# EAGLE design Cubesat_Potencia_Backup-rev2 (EAGLE 7.2.0)

## Sheet 1 of 4: Controle Painel Solar+ Mux AD
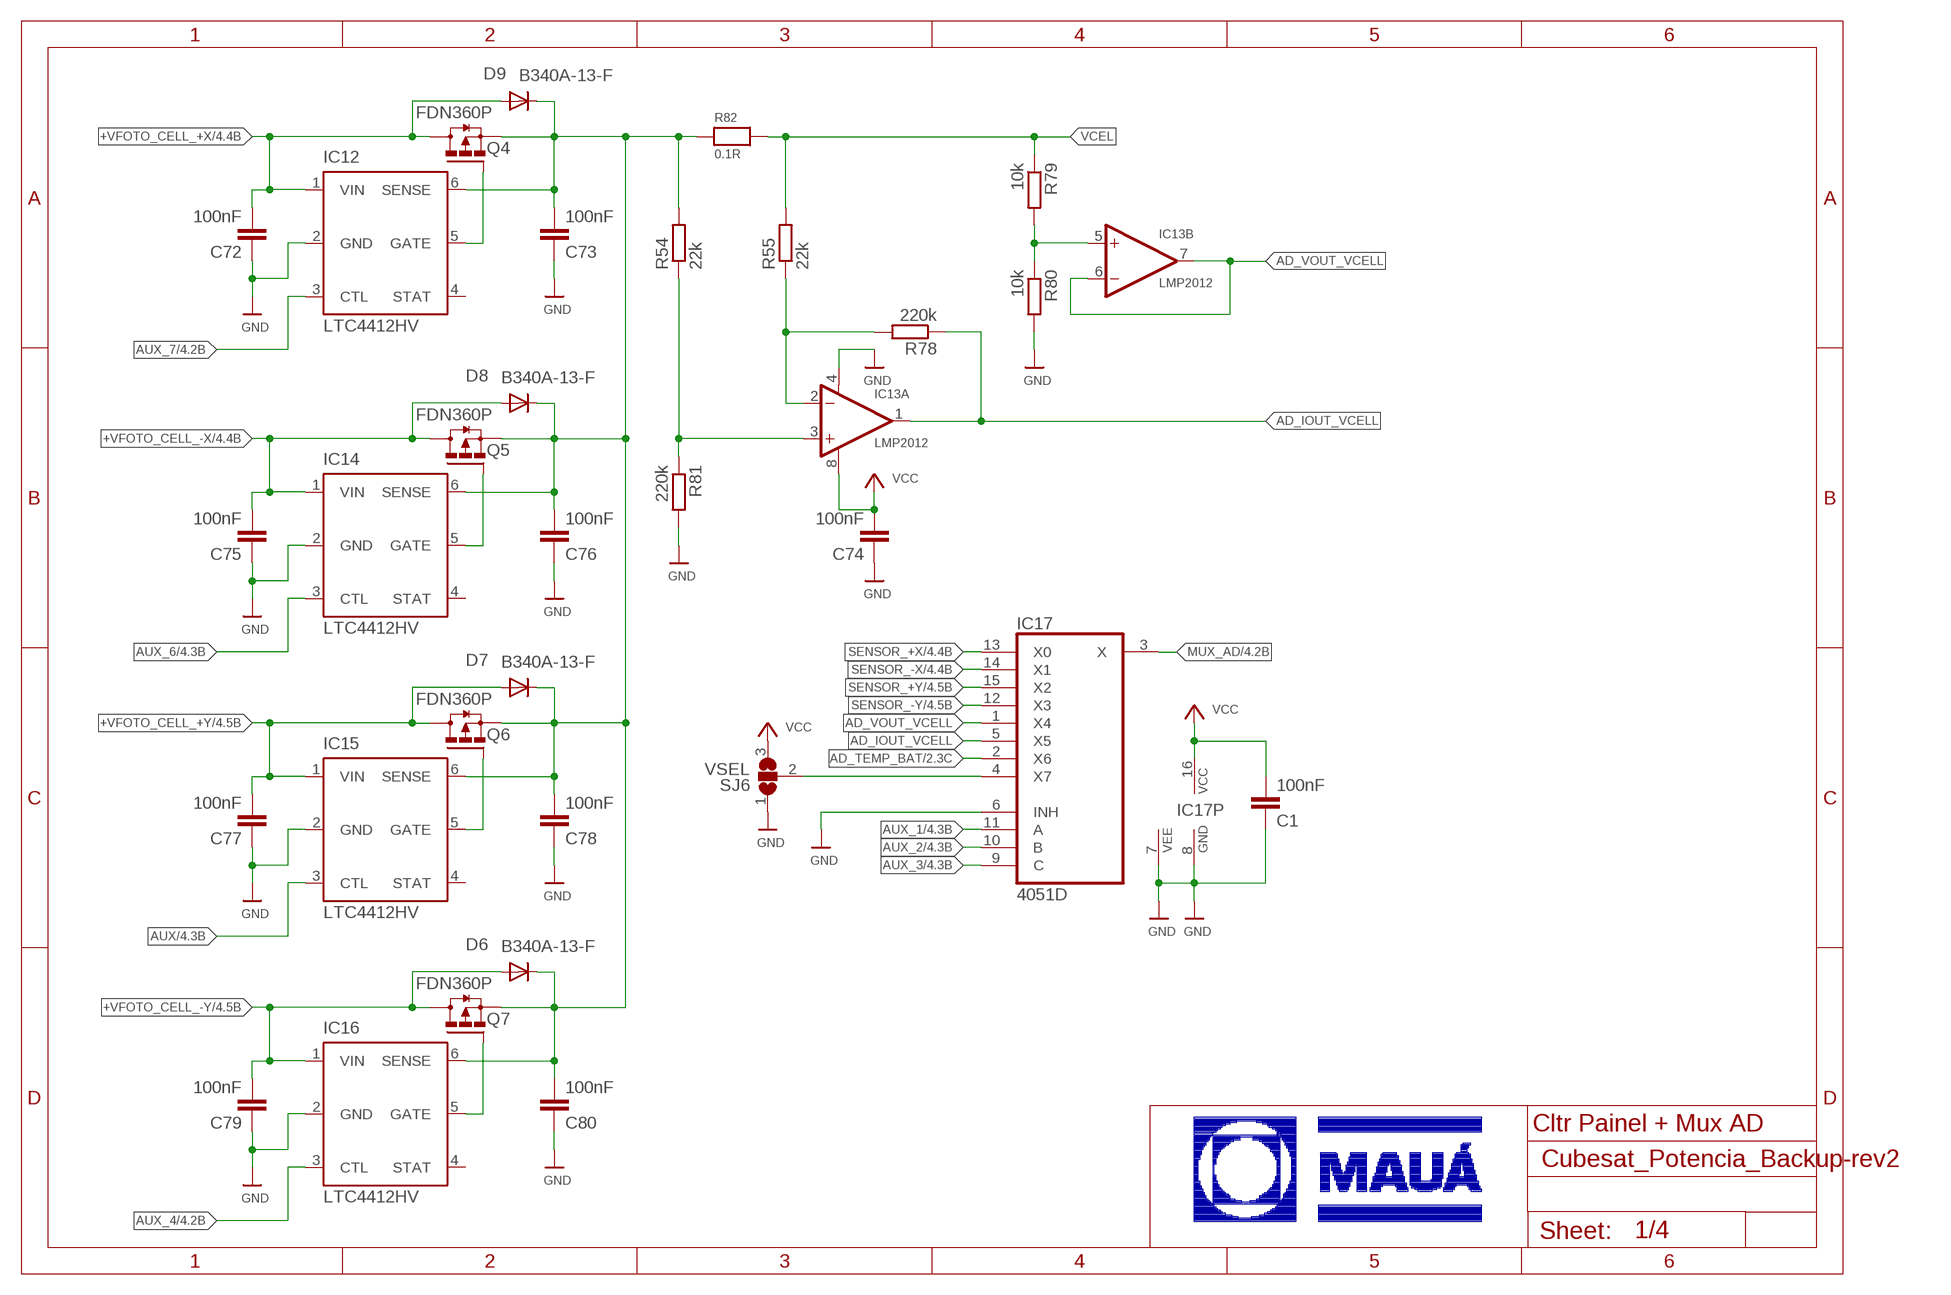
[diagram p0: schematic, sheet 1]

### Parts
C1  100nF  C-EUC0805  [C0805]
C72  100nF  C-EUC0805  [C0805]
C73  100nF  C-EUC0805  [C0805]
C74  100nF  C-EUC0805  [C0805]
C75  100nF  C-EUC0805  [C0805]
C76  100nF  C-EUC0805  [C0805]
C77  100nF  C-EUC0805  [C0805]
C78  100nF  C-EUC0805  [C0805]
C79  100nF  C-EUC0805  [C0805]
C80  100nF  C-EUC0805  [C0805]
D6  B340A-13-F  DIODE-DO214AC  [DO214AC]
D7  B340A-13-F  DIODE-DO214AC  [DO214AC]
D8  B340A-13-F  DIODE-DO214AC  [DO214AC]
D9  B340A-13-F  DIODE-DO214AC  [DO214AC]
IC12  LTC4412HV  [TSOT23-6]
IC13  LMP2012  OPA2237E  [MSOP08]
IC14  LTC4412HV  [TSOT23-6]
IC15  LTC4412HV  [TSOT23-6]
IC16  LTC4412HV  [TSOT23-6]
IC17  4051D  [SO16]
Q4  FDN360P  [SUPER-SOT3]
Q5  FDN360P  [SUPER-SOT3]
Q6  FDN360P  [SUPER-SOT3]
Q7  FDN360P  [SUPER-SOT3]
R54  22k  R-EU_M0805  [M0805]
R55  22k  R-EU_M0805  [M0805]
R78  220k  R-EU_M0805  [M0805]
R79  10k  R-EU_M0805  [M0805]
R80  10k  R-EU_M0805  [M0805]
R81  220k  R-EU_M0805  [M0805]
R82  0.1R  RESISTOR2818  [_2818]
SJ6  VSEL  SJ2W  [SJ_2]

### Nets
+VFOTO_CELL_+X: C72.2 D9.A IC12.1(VIN) Q4.3(D) ; also sheet 4
+VFOTO_CELL_+Y: C77.2 D7.A IC15.1(VIN) Q6.3(D) ; also sheet 4
+VFOTO_CELL_-X: C75.2 D8.A IC14.1(VIN) Q5.3(D) ; also sheet 4
+VFOTO_CELL_-Y: C79.2 D6.A IC16.1(VIN) Q7.3(D) ; also sheet 4
AD_IOUT_VCELL: IC13.1(A:OUT) IC17.5(X5) R78.1
AD_TEMP_BAT: IC17.2(X6) ; also sheet 2
AD_VOUT_VCELL: IC13.6(B:-IN) IC13.7(B:OUT) IC17.1(X4)
AUX: IC15.3(CTL) ; also sheet 4
AUX_1: IC17.11(A) ; also sheet 4
AUX_2: IC17.10(B) ; also sheet 4
AUX_3: IC17.9(C) ; also sheet 4
AUX_4: IC16.3(CTL) ; also sheet 4
AUX_6: IC14.3(CTL) ; also sheet 4
AUX_7: IC12.3(CTL) ; also sheet 4
GND: C1.1 C72.1 C73.1 C74.1 C75.1 C76.1 C77.1 C78.1 C79.1 C80.1 IC12.2(GND) IC13.4(A:V-) IC14.2(GND) IC15.2(GND) IC16.2(GND) IC17.6(INH) IC17.7(VEE) IC17.8(GND) R80.2 R81.2 SJ6.1 ; also sheet 2,3,4
MUX_AD: IC17.3(X) ; also sheet 4
N$74: IC12.5(GATE) Q4.1(G)
N$75: IC13.5(B:+IN) R79.2 R80.1
N$76: IC13.2(A:-IN) R55.1 R78.2
N$77: IC13.3(A:+IN) R54.1 R81.1
N$78: C73.2 C76.2 C78.2 C80.2 D6.C D7.C D8.C D9.C IC12.6(SENSE) IC14.6(SENSE) IC15.6(SENSE) IC16.6(SENSE) Q4.2(S) Q5.2(S) Q6.2(S) Q7.2(S) R54.2 R82.1
N$79: IC17.4(X7) SJ6.2
N$81: IC14.5(GATE) Q5.1(G)
N$82: IC15.5(GATE) Q6.1(G)
N$83: IC16.5(GATE) Q7.1(G)
SENSOR_+X: IC17.13(X0) ; also sheet 4
SENSOR_+Y: IC17.15(X2) ; also sheet 4
SENSOR_-X: IC17.14(X1) ; also sheet 4
SENSOR_-Y: IC17.12(X3) ; also sheet 4
VCC: C1.2 C74.2 IC13.8(A:V+) IC17.16(VCC) SJ6.3 ; also sheet 2,4
VCEL: R55.2 R79.1 R82.2 ; also sheet 2
Unconnected: IC12.4(STAT) IC14.4(STAT) IC15.4(STAT) IC16.4(STAT)

### Notes on the sheet
- Cltr Painel + Mux AD

## Sheet 2 of 4: Carregador de Bateria
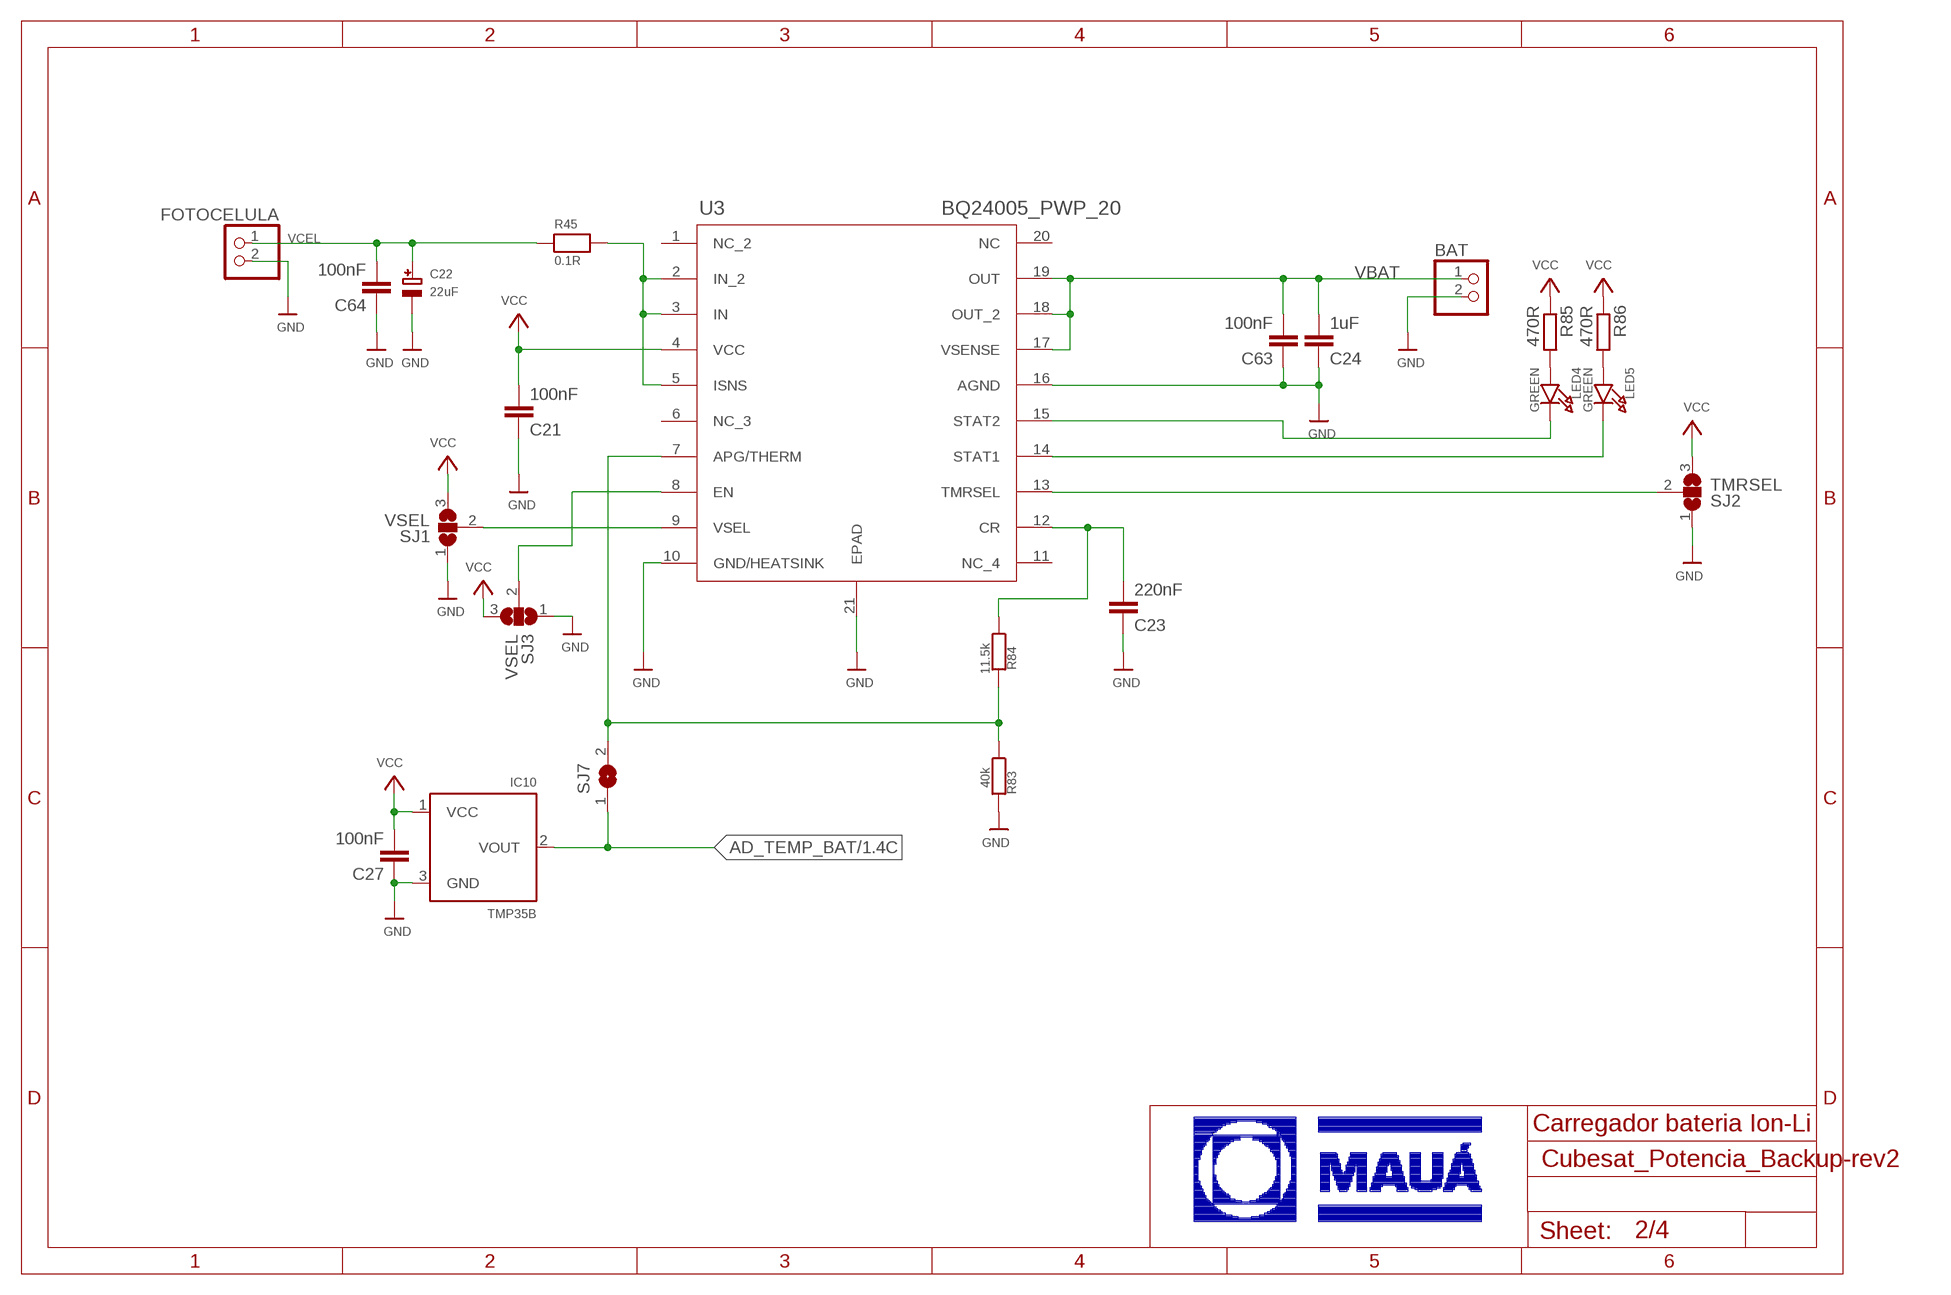
[diagram p1: schematic, sheet 2]

### Parts
BAT  HEADER-1X2  [1X02_OVAL]
C21  100nF  C-EUC0805  [C0805]
C22  22uF  CAP_TANTALUMC/6032_REFLOW  [EIA6032-28/C-R]
C23  220nF  C-EUC0805  [C0805]
C24  1uF  C-EUC0805  [C0805]
C27  100nF  C-EUC0805  [C0805]
C63  100nF  C-EUC0805  [C0805]
C64  100nF  C-EUC0805  [C0805]
FOTOCELULA  HEADER-1X2  [1X02_OVAL]
IC10  TMP35B  [TO92-LINE]
LED4  GREEN  LED0805  [CHIPLED_0805]
LED5  GREEN  LED0805  [CHIPLED_0805]
R45  0.1R  RESISTOR2818  [_2818]
R83  40k  R-EU_M0805  [M0805]
R84  11.5k  R-EU_M0805  [M0805]
R85  470R  R-EU_M0805  [M0805]
R86  470R  R-EU_M0805  [M0805]
SJ1  VSEL  SJ2W  [SJ_2]
SJ2  TMRSEL  SJ2W  [SJ_2]
SJ3  VSEL  SJ2W  [SJ_2]
SJ7  SOLDERJUMPER  [SOLDERJUMPER_ARROW_NOPASTE]
U3  BQ24005_PWP_20  [PWP20_2P4X3P4]

### Nets
AD_TEMP_BAT: IC10.2(VOUT) SJ7.1 ; also sheet 1
GND: BAT.2 C21.1 C22.- C23.1 C24.1 C27.1 C63.1 C64.1 FOTOCELULA.2 IC10.3(GND) R83.2 SJ1.1 SJ2.1 SJ3.1 U3.10(GND/HEATSINK) U3.16(AGND) U3.21(EPAD) ; also sheet 1,3,4
N$1: SJ3.2 U3.8(EN)
N$33: R45.2 U3.2(IN_2) U3.3(IN) U3.5(ISNS)
N$38: SJ2.2 U3.13(TMRSEL)
N$46: SJ1.2 U3.9(VSEL)
N$48: C23.2 R84.1 U3.12(CR)
N$80: LED4.A R85.2
N$84: R83.1 R84.2 SJ7.2 U3.7(APG/THERM)
N$86: LED5.A R86.2
N$87: LED5.C U3.14(STAT1)
N$88: LED4.C U3.15(STAT2)
VBAT: BAT.1 C24.2 C63.2 U3.17(VSENSE) U3.18(OUT_2) U3.19(OUT) ; also sheet 3,4
VCC: C21.2 C27.2 IC10.1(VCC) R85.1 R86.1 SJ1.3 SJ2.3 SJ3.3 U3.4(VCC) ; also sheet 1,4
VCEL: C22.+ C64.2 FOTOCELULA.1 R45.1 ; also sheet 1
Unconnected: U3.1(NC_2) U3.6(NC_3) U3.11(NC_4) U3.20(NC)

### Notes on the sheet
- Carregador bateria Ion-Li

## Sheet 3 of 4: Conversor BACKUP
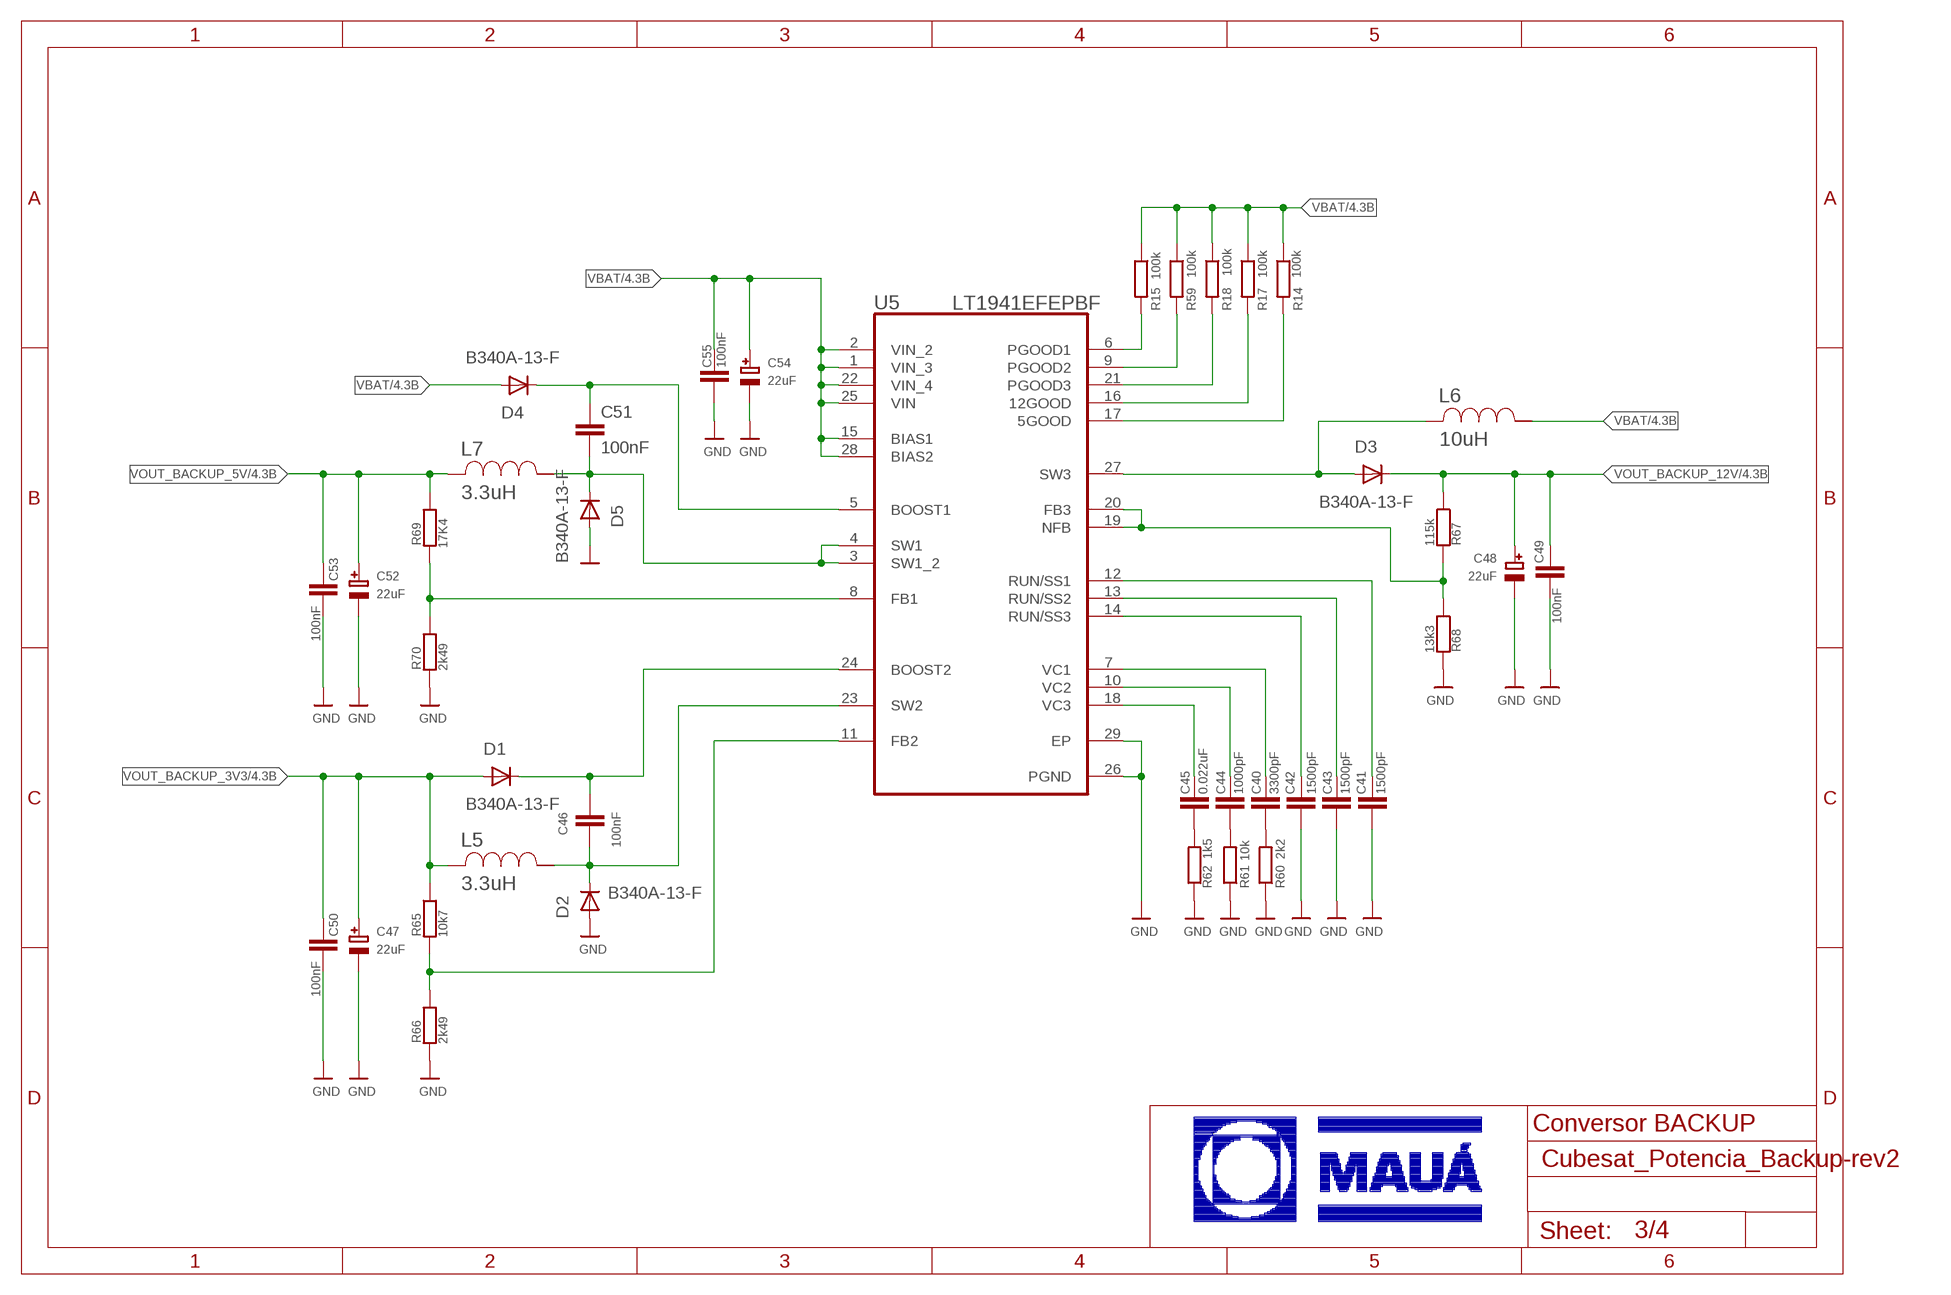
[diagram p2: schematic, sheet 3]

### Parts
C40  3300pF  C-EUC0805  [C0805]
C41  1500pF  C-EUC0805  [C0805]
C42  1500pF  C-EUC0805  [C0805]
C43  1500pF  C-EUC0805  [C0805]
C44  1000pF  C-EUC0805  [C0805]
C45  0.022uF  C-EUC0805  [C0805]
C46  100nF  C-EUC0805  [C0805]
C47  22uF  CAP_TANTALUMC/6032_REFLOW  [EIA6032-28/C-R]
C48  22uF  CAP_TANTALUMC/6032_REFLOW  [EIA6032-28/C-R]
C49  100nF  C-EUC0805  [C0805]
C50  100nF  C-EUC0805  [C0805]
C51  100nF  C-EUC1210  [C1210]
C52  22uF  CAP_TANTALUMC/6032_REFLOW  [EIA6032-28/C-R]
C53  100nF  C-EUC0805  [C0805]
C54  22uF  CAP_TANTALUMC/6032_REFLOW  [EIA6032-28/C-R]
C55  100nF  C-EUC0805  [C0805]
D1  B340A-13-F  DIODE-DO214AC  [DO214AC]
D2  B340A-13-F  DIODE-DO214AC  [DO214AC]
D3  B340A-13-F  DIODE-DO214AC  [DO214AC]
D4  B340A-13-F  DIODE-DO214AC  [DO214AC]
D5  B340A-13-F  DIODE-DO214AC  [DO214AC]
L5  3.3uH  SRR6038-3R3Y  [SRR6038]
L6  10uH  SRR6038-3R3Y  [SRR6038]
L7  3.3uH  SRR6038-3R3Y  [SRR6038]
R14  100k  R-EU_M0805  [M0805]
R15  100k  R-EU_M0805  [M0805]
R17  100k  R-EU_M0805  [M0805]
R18  100k  R-EU_M0805  [M0805]
R59  100k  R-EU_M0805  [M0805]
R60  2k2  R-EU_M0805  [M0805]
R61  10k  R-EU_M0805  [M0805]
R62  1k5  R-EU_M0805  [M0805]
R65  10k7  R-EU_M0805  [M0805]
R66  2k49  R-EU_M0805  [M0805]
R67  115k  R-EU_M0805  [M0805]
R68  13k3  R-EU_M0805  [M0805]
R69  17K4  R-EU_M0805  [M0805]
R70  2k49  R-EU_M0805  [M0805]
U5  LT1941EFEPBF  [SOP65P640X120-29N]

### Nets
BOOST1: C51.1 D4.C U5.5(BOOST1)
FB1: R69.2 R70.1 U5.8(FB1)
FB2: R65.2 R66.1 U5.11(FB2)
FB3: R67.2 R68.1 U5.19(NFB) U5.20(FB3)
GND: C41.2 C42.2 C43.2 C47.- C48.- C49.2 C50.2 C52.- C53.2 C54.- C55.2 D2.A D5.A R60.1 R61.1 R62.1 R66.2 R68.2 R70.2 U5.26(PGND) U5.29(EP) ; also sheet 1,2,4
N$19: R14.2 U5.17(5GOOD)
N$21: R17.2 U5.16(12GOOD)
N$27: R18.2 U5.21(PGOOD3)
N$29: R59.2 U5.9(PGOOD2)
N$54: R15.2 U5.6(PGOOD1)
N$55: C41.1 U5.12(RUN/SS1)
N$56: C43.1 U5.13(RUN/SS2)
N$57: C42.1 U5.14(RUN/SS3)
N$59: C40.1 R60.2
N$62: C44.2 U5.10(VC2)
N$63: C45.2 U5.18(VC3)
N$67: C44.1 R61.2
N$68: C45.1 R62.2
N$69: C40.2 U5.7(VC1)
N$70: C46.1 D1.C U5.24(BOOST2)
SW1: C51.2 D5.C L7.2 U5.3(SW1_2) U5.4(SW1)
SW2: C46.2 D2.C L5.2 U5.23(SW2)
SW3: D3.A L6.1 U5.27(SW3)
VBAT: C54.+ C55.1 D4.A L6.2 R14.1 R15.1 R17.1 R18.1 R59.1 U5.1(VIN_3) U5.2(VIN_2) U5.15(BIAS1) U5.22(VIN_4) U5.25(VIN) U5.28(BIAS2) ; also sheet 2,4
VOUT_BACKUP_3V3: C47.+ C50.1 D1.A L5.1 R65.1 ; also sheet 4
VOUT_BACKUP_5V: C52.+ C53.1 L7.1 R69.1 ; also sheet 4
VOUT_BACKUP_12V: C48.+ C49.1 D3.C R67.1 ; also sheet 4

### Notes on the sheet
- Conversor BACKUP

## Sheet 4 of 4: Barramento
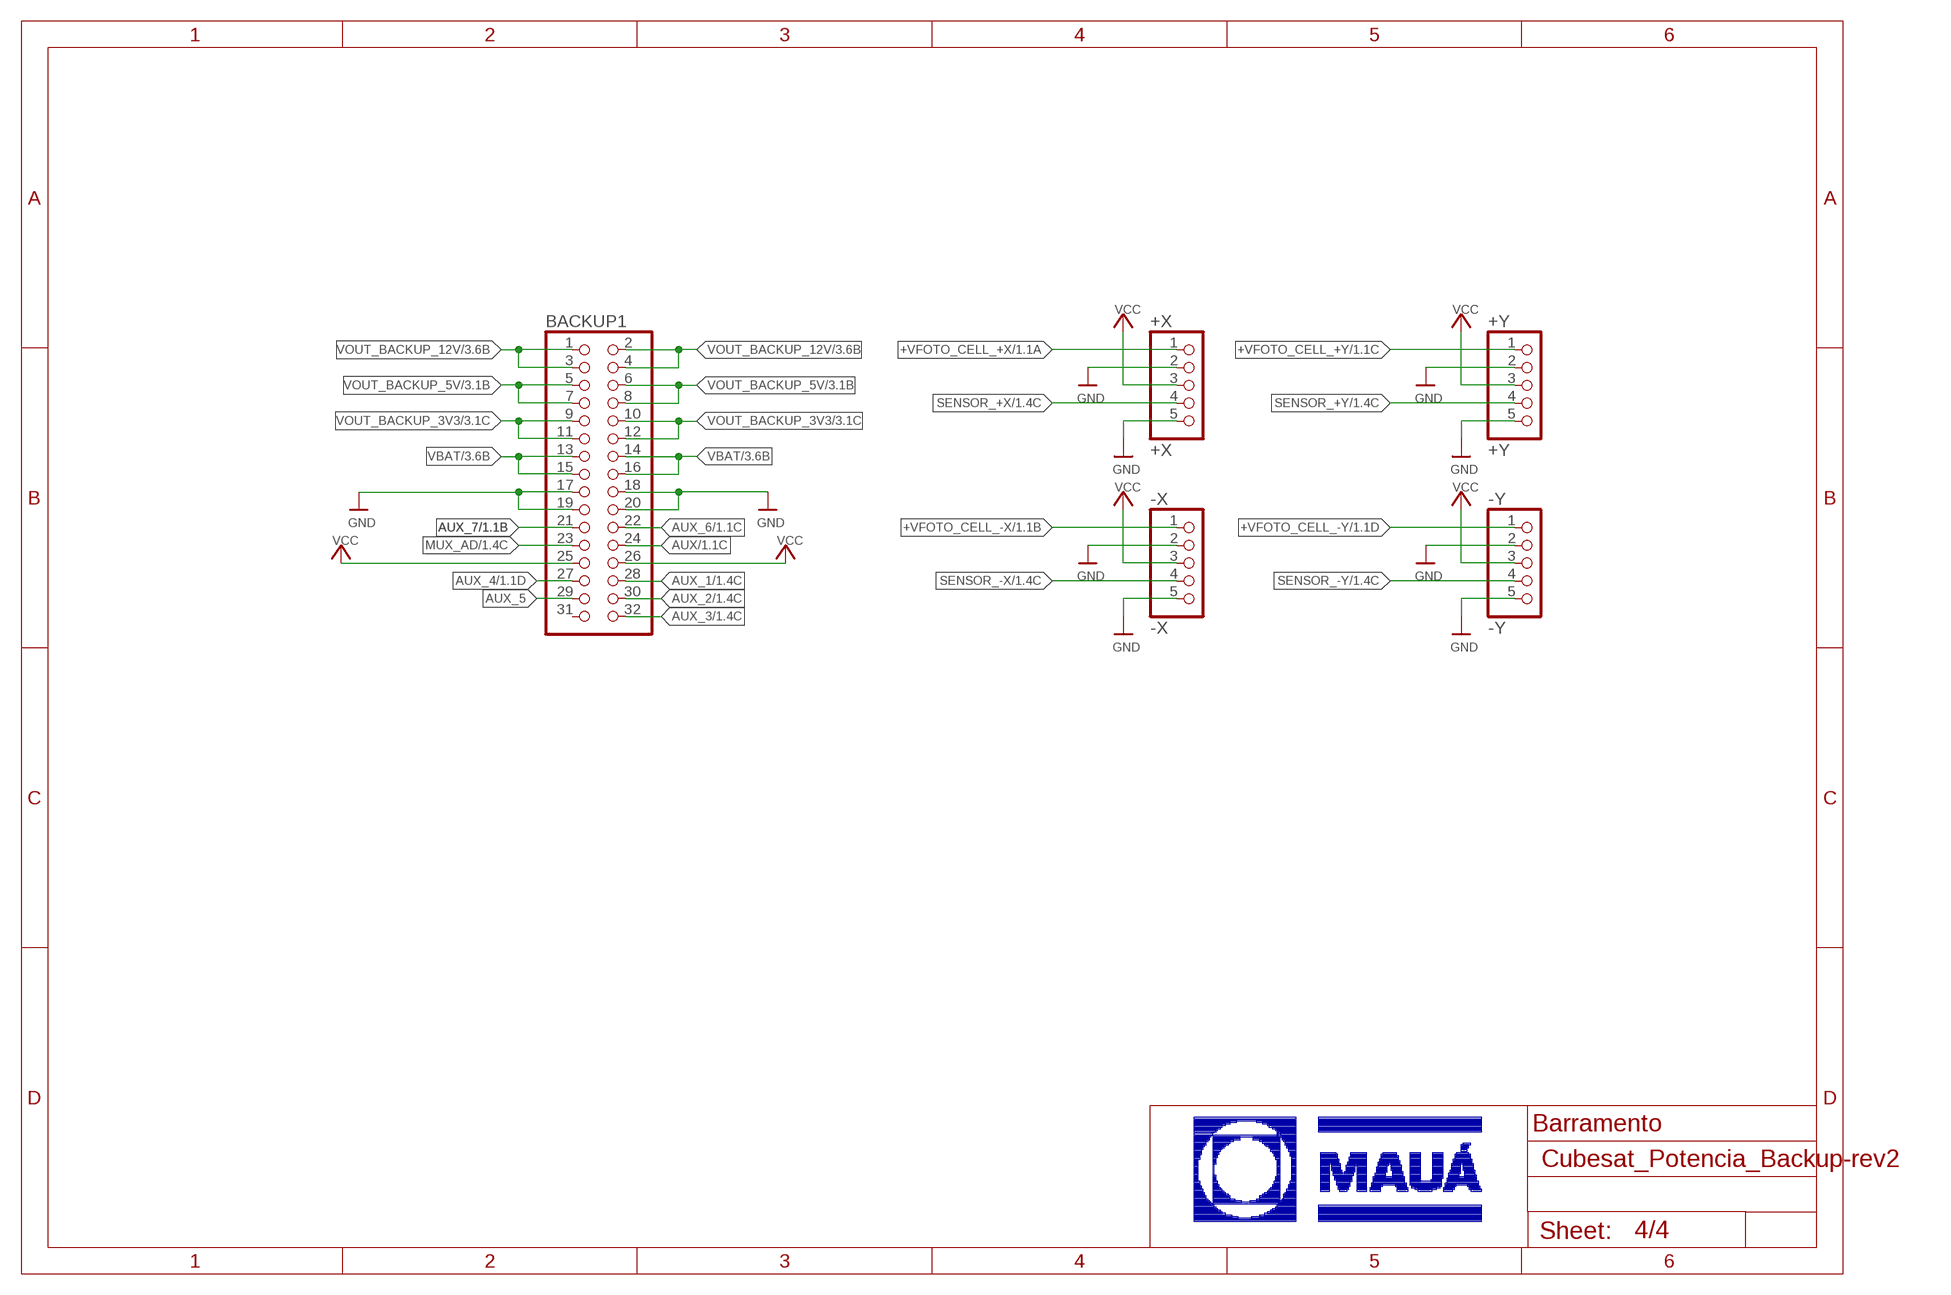
[diagram p3: schematic, sheet 4]

### Parts
+X  +X  PINHD-1X5  [1X05]
+Y  +Y  PINHD-1X5  [1X05]
-X  -X  PINHD-1X5  [1X05]
-Y  -Y  PINHD-1X5  [1X05]
BACKUP1  PINHD-2X16  [2X16]

### Nets
+VFOTO_CELL_+X: +X.1 ; also sheet 1
+VFOTO_CELL_+Y: +Y.1 ; also sheet 1
+VFOTO_CELL_-X: -X.1 ; also sheet 1
+VFOTO_CELL_-Y: -Y.1 ; also sheet 1
AUX: BACKUP1.24 ; also sheet 1
AUX_1: BACKUP1.28 ; also sheet 1
AUX_2: BACKUP1.30 ; also sheet 1
AUX_3: BACKUP1.32 ; also sheet 1
AUX_4: BACKUP1.27 ; also sheet 1
AUX_5: BACKUP1.29
AUX_6: BACKUP1.22 ; also sheet 1
AUX_7: BACKUP1.21 ; also sheet 1
GND: +X.2 +X.5 +Y.2 +Y.5 -X.2 -X.5 -Y.2 -Y.5 BACKUP1.17 BACKUP1.18 BACKUP1.19 BACKUP1.20 ; also sheet 1,2,3
MUX_AD: BACKUP1.23 ; also sheet 1
SENSOR_+X: +X.4 ; also sheet 1
SENSOR_+Y: +Y.4 ; also sheet 1
SENSOR_-X: -X.4 ; also sheet 1
SENSOR_-Y: -Y.4 ; also sheet 1
VBAT: BACKUP1.13 BACKUP1.14 BACKUP1.15 BACKUP1.16 ; also sheet 2,3
VCC: +X.3 +Y.3 -X.3 -Y.3 BACKUP1.25 BACKUP1.26 ; also sheet 1,2
VOUT_BACKUP_3V3: BACKUP1.9 BACKUP1.10 BACKUP1.11 BACKUP1.12 ; also sheet 3
VOUT_BACKUP_5V: BACKUP1.5 BACKUP1.6 BACKUP1.7 BACKUP1.8 ; also sheet 3
VOUT_BACKUP_12V: BACKUP1.1 BACKUP1.2 BACKUP1.3 BACKUP1.4 ; also sheet 3
Unconnected: BACKUP1.31

### Notes on the sheet
- Barramento

## Library data of the parts
+X +Y -X -Y = pinhead:PINHD-1X5: PIN HEADER
BACKUP1 = pinhead:PINHD-2X16: PIN HEADER
BAT FOTOCELULA = junior:HEADER-1X2: PIN HEADER
C1 C21 C23 C24 C27 C40-C46 C49-C51 C53 C55 C63 C64 C72-C80 = rcl:C-EU: CAPACITOR, European symbol
C22 C47 C48 C52 C54 = junior:CAP_TANTALUM: Tantalum Capacitors Wave footprints have larger pads and are meant to be used for hand soldering. Reflow footprints are optimised for solder paste and a reflow oven. EIA3216-18/A-[R/W] - Size A / 3216-18 / 1206 footprint 4.7µF 25V 10% Tantalum Capacitor 10µF 16V 10% Tantalum Capacitor [Digikey: 495-2236-2-ND] EIA3528-21/B-[R/W] - Size B / 3528-21 47µF 10V 10% Tantalum Capactior [Digikey: 495-2216-1-ND] EIA6032-28/C-[R/W] - Size C / 6032-28 10µF 35V 20% Tantalum Capacitor [Digikey: 495-2285-1-ND] 100µF 16V 10% Tantalum Capactior [Digikey: 399-5214-1-ND]
D1-D9 = diode:DIODE-: DIODE
IC10 = junior:TMP35
IC12 IC14-IC16 = linear-technology:LTC4412HV
IC13 = burr-brown:OPA2237: Single-Supply Operational Amplifiers MicroAmplifier(TM) Series; Product Folder:OPA2237; MF: TEXAS INSTRUMENTS; MPN: OPA2237EA/250; OC_FARNELL: 1470365; OC_NEWARK: 35C1853
IC17 = 40xx:4051: 8-channel ANALOG MULTIPLEXER
L5-L7 = lbr_tcc:SRR6038-3R3Y; DCR: 0.02; IDC: 3.5; L: 3.3E-6; MANUFACTURER_NAME: Bourns; MANUFACTURER_PART_NUMBER: SRR6038-3R3Y; VENDOR: Bourns
LED4 LED5 = junior:LED: LED 0603 - 0603 Surface Mount Package 2mA: Green LED - Low Power (3.9mcd, 2ma, 1.7Vf) - Digikey: 475-2709-2-ND Orange LED - Low Power (9.8mcd, 2ma, 1.8Vf) - Digikey: 475-1194-2-ND Red LED - Low Power (5mcd, 2ma, 1.8Vf) - Digikey: 475-1195-2-ND Yellow LED - Low Power (7mcd, 2ma, 1.8Vf) - Digikey: 475-1196-2-ND 5mA: Blue LED - Low Power (17mcd, 5ma, 2.9Vf) - Digikey: LNJ937W8CRACT-ND 0805 - 0805 Surface Mount Package 2mA: Red LED (8.8mcd, 2mA, 1.8Vf, Clear) - Low Power [Digikey: 475-2510-1-ND] Green LED (5mcd, 2mA, 1.8Vf, Clear) - Low Power [Digikey: 475-2730-1-ND] Yellow LED (11.3mcd, 2mA, 1.8Vf, Clear) - Low Power [Digikey: 475-2555-1-ND] 20mA: Red LED (104mcd, 20mA, Diffused) - LS R976 [Digikey: 475-1278-6-ND] Red LED (12mcd, 20mA, 2.0Vf, Clear) - APT2012EC [Digikey: 754-1128-1-ND] Green LED (15mcd, 20mA, 2.2Vf, Clear) - APT2012GC [Digikey: 754-1131-1-ND] Orange LED (160mcd, 20mA, 2.1Vf, Clear) - APT2012SECK [Digikey: 754-1130-1-ND] 1206 - 1206 Surface Mount Package Green LED (26mcd, 20mA, Diffused) - LG N971 [Digikey: 475-1407-6-ND] Red LED (15mcd, 20mA, Diffused) - LH N974 [Digikey: 475-1416-6-ND]
Q4-Q7 = transistor-power:FDN360P: Single P-Channel, PowerTrench (R) MOSFET Source: http://www.fairchildsemi.com/ds/FD/FDN360P.pdf
R14 R15 R17 R18 R54 R55 R59-R62 R65-R70 R78-R81 R83-R86 = rcl:R-EU_: RESISTOR, European symbol
R45 R82 = junior:RESISTOR: Resistors 0402 - 0402 Surface Mount Package 22 Ohm 1% 1/16W [Digikey: 311-22.0LRTR-ND] 33 Ohm 5% 1/16W 1.0K 5% 1/16W 1.5K 5% 1/16W 2.0K 1% 1/16W 10.0K 1% 1/16W [Digikey: 311-10.0KLRTR-ND] 10.0K 5% 1/16W [Digikey: RMCF0402JT10K0TR-ND] 12.1K 1% 1/16W [Digikey: 311-22.0LRTR-ND] 100.0K 5% 1/16W 0603 - 0603 Surface Mount Package 0 Ohm 1/10 Watt 1% Resistor 15 Ohm 1/10 Watt 1% Resistor 33 Ohm 1/10 Watt 1% Resistor 49.9 Ohm 1/10 Watt 1% Resistor 100 Ohm 1/10 Watt 1% Resistor 150 Ohm 1/10 Watt 1% Resistor 240 Ohm 1/10 Watt 1% Resistor 390 Ohm 1/10 Watt 1% Resistor 560 Ohm 1/10 Watt 1% Resistor 680 Ohm 1/10 Watt 1% Resistor 750 Ohm 1/10 Watt 1% Resistor 1.0K Ohm 1/10 Watt 1% Resistor 1.5K Ohm 1/10 Watt 1% Resistor 2.0K Ohm 1/10 Watt 1% Resistor 2.2K Ohm 1/10 Watt 1% Resistor 3.3K Ohm 1/10 Watt 1% Resistor 4.7K Ohm 1/10 Watt 1% Resistor 10.0K Ohm 1/10 Watt 1% Resistor 12.0K Ohm 1/10 Watt 1% Resistor 12.1K Ohm 1/10 Watt 1% Resistor 20.0K Ohm 1/10 Watt 1% Resistor 33.0K Ohm 1/10 Watt 1% Resistor 100.0K Ohm 1/10 Watt 1% Resistor 0805 - 0805 Surface Mount Package 0 Ohm 1/8 Watt 1% Resistor 33 Ohm 1/8 Watt 1% Resistor 100 Ohm 1/8 Watt 1% Resistor 150 Ohm 1/8 Watt 1% Resistor 200 Ohm 1/8 Watt 1% Resistor 240 Ohm 1/8 Watt 1% Resistor 330 Ohm 1/8 Watt 1% Resistor 390 Ohm 1/8 Watt 1% Resistor 470 Ohm 1/8 Watt 1% Resistor 1.0K Ohm 1/8 Watt 1% Resistor 1.5K Ohm 1/8 Watt 1% Resistor 2.0K Ohm 1/8 Watt 1% Resistor 4.7K Ohm 1/8 Watt 1% Resistor 5.1K Ohm 1/8 Watt 1% Resistor 5.6K Ohm 1/8 Watt 1% Resistor 10.0K Ohm 1/8 Watt 1% Resistor 22.0K Ohm 1/8 Watt 1% Resistor 33.0K Ohm 1/8 Watt 1% Resistor 100K Ohm 1/8 Watt 1% Resistor 1206 - 1206 Surface Mount Package 2012 - 2010 Surface Mount Package 0.11 Ohm 1/2 Watt 1% Resistor - Digikey: RHM.11UCT-ND
SJ1-SJ3 SJ6 = jumper:SJ2W: SMD solder JUMPER
SJ7 = junior:SOLDERJUMPER: SMD Solder JUMPER Solder the two pads together to create a connection, or remove the solder to break it. REFLOW - Use this footprint for solder paste and reflow ovens. WAVE - Use this footprint for hand-soldering (larger pads). CLOSED - Has a trace between the two pads to ensure it is closed by default. The trace needs to be cut to disable the jumper, and can be closed again by creating a solder bridge between the two pads.; BOM: EXCLUDE
U3 = BQ24005:BQ24005_PWP_20; DATASHEETURL: http://www.ti.com/lit/gpn/BQ24005; DESCRIPTION: Linear 2-cell Li-Ion Battery Charger w/Integrated FET, Two LED; FAMILY_NAME: BATTERY CHARGE MANAGEMENT; GENERIC_PART_NUMBER: BQ24005; INDUSTRY_STD_PKG_TYPE: HTSSOP; MANUFACTURER: Texas Instruments; PACKAGE_DESIGNATOR: PWP; PIN_COUNT: 20
U5 = LTC_By_element14_Batch_1:LT1941EFEPBF: Switching Regulator; MPN: LT1941EFE#PBF; OC_FARNELL: 1273793; OC_NEWARK: 58M1020; PACKAGE: TSSOP-28; SUPPLIER: Linear Technology

## Board
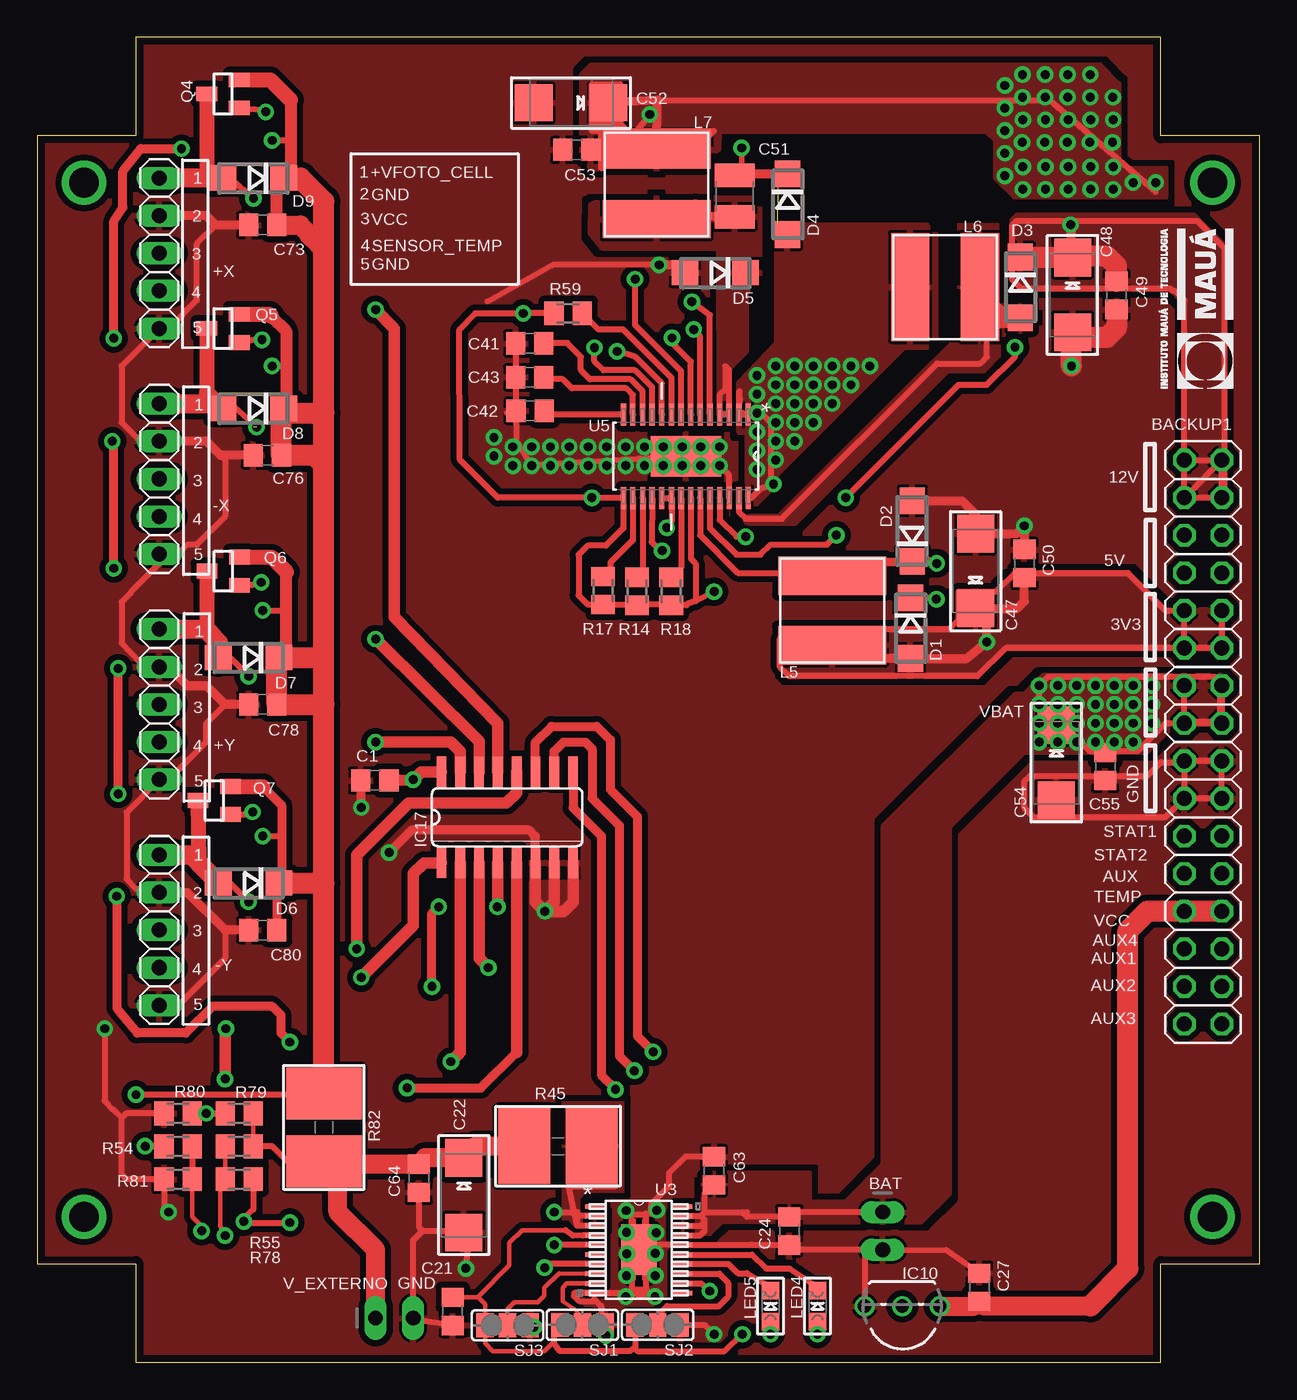
[diagram p4: board, top side]
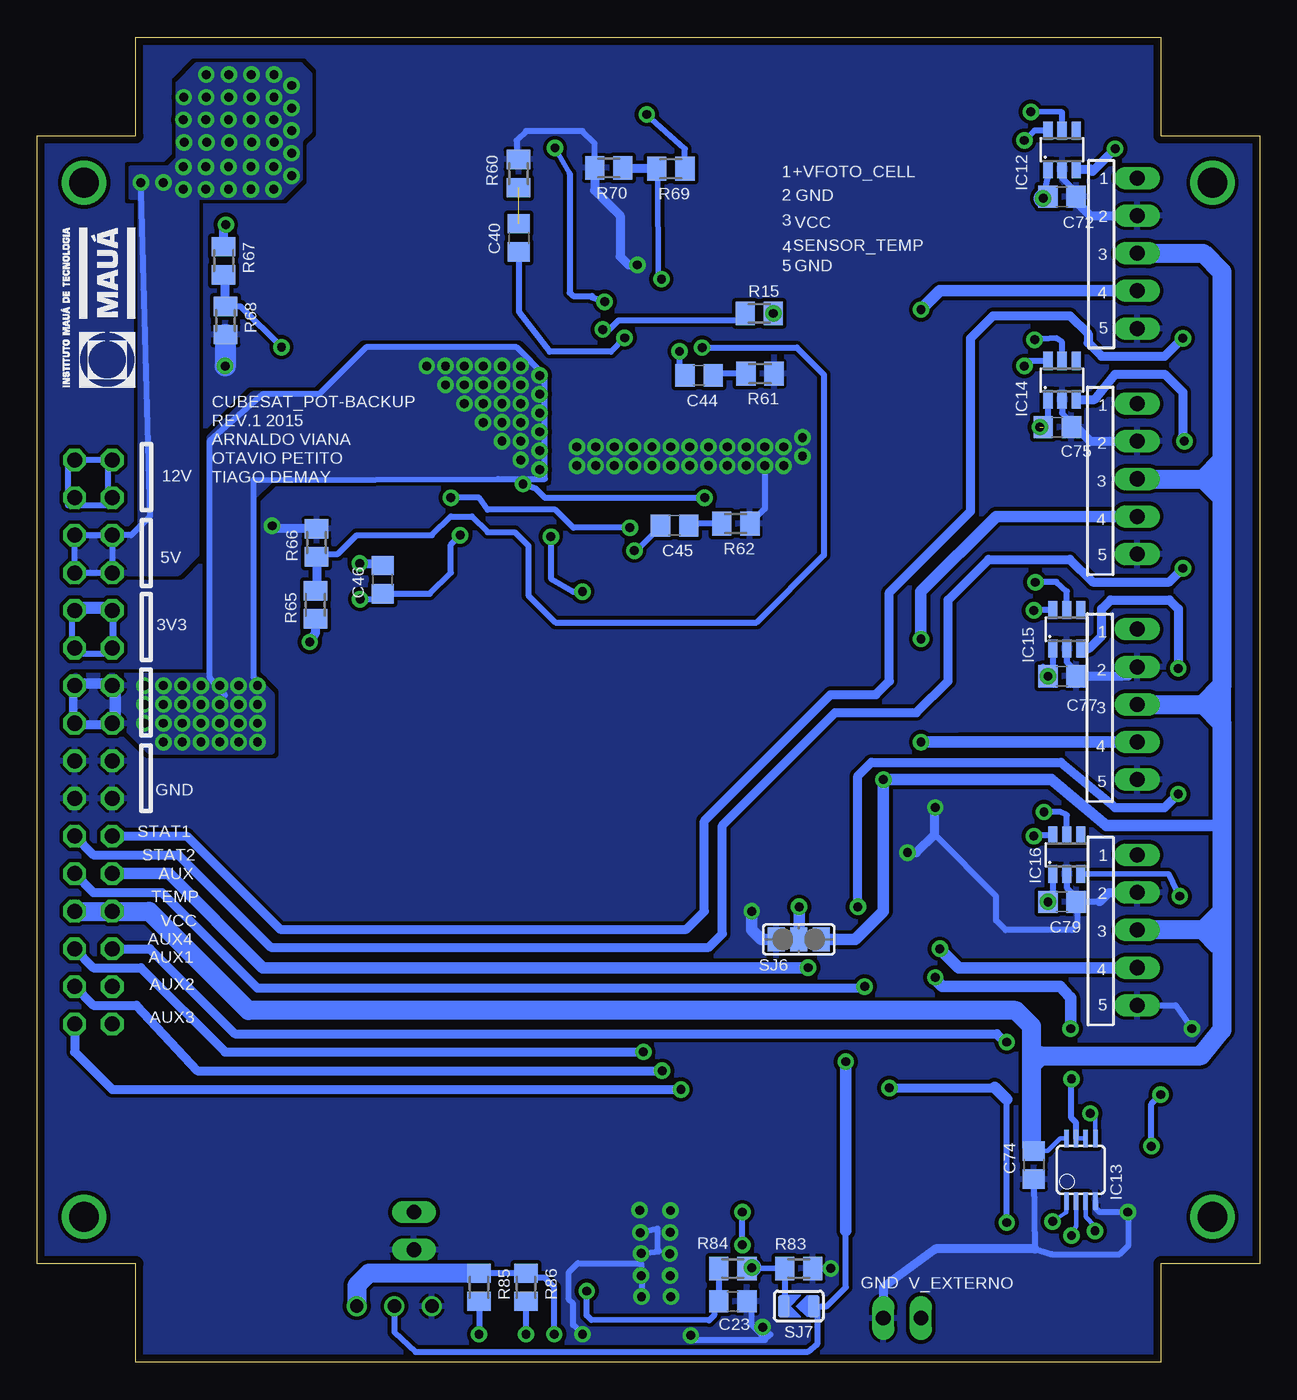
[diagram p5: board, bottom side, seen from below]

Size 82.55 x 89.53 mm. Coordinates in mm from the lower left corner, seen from the top.
Outline: 0,82.87 0,6.67 6.67,6.67 6.67,0 75.88,0 75.88,6.67 82.55,6.67 82.55,82.87 75.88,82.87 75.88,89.53 6.67,89.53 6.67,82.87 0,82.87
Copper layers (1*16): Top 0.035mm / dielectric 1.5mm / Bottom 0.035mm
Design rules "default": minimum track width 8mil, minimum drill 0.4mm, track to track 8mil, track to pad 8mil, pad to pad 8mil, via to via 8mil, smd to smd 8mil, copper to edge 20mil, drill to drill 8mil, minimum pad ring 8mil, minimum via ring 10mil, stop-mask expansion 3mil, vias tented up to drill 0mil, thermal gap 8mil

### Footprints (pad centres in the part's own frame; a part is rotated, then mirrored left to right if it is on the bottom)
1X05 = drill 1.016 long: 1 -5.08,0; 2 -2.54,0; 3 0,0; 4 2.54,0; 5 5.08,0
2X16 = drill 1.016 octagon: 1 -19.05,-1.27; 2 -19.05,1.27; 3 -16.51,-1.27; 4 -16.51,1.27; 5 -13.97,-1.27; 6 -13.97,1.27; 7 -11.43,-1.27; 8 -11.43,1.27; 9 -8.89,-1.27; 10 -8.89,1.27; 11 -6.35,-1.27; 12 -6.35,1.27; 13 -3.81,-1.27; 14 -3.81,1.27; 15 -1.27,-1.27; 16 -1.27,1.27; 17 1.27,-1.27; 18 1.27,1.27; 19 3.81,-1.27; 20 3.81,1.27; 21 6.35,-1.27; 22 6.35,1.27; 23 8.89,-1.27; 24 8.89,1.27; 25 11.43,-1.27; 26 11.43,1.27; 27 13.97,-1.27; 28 13.97,1.27; 29 16.51,-1.27; 30 16.51,1.27; 31 19.05,-1.27; 32 19.05,1.27
1X02_OVAL = drill 1 long: 1 -1.27,0; 2 1.27,0
C0805 = smd 1.3 x 1.5: 1 -0.95,0; 2 0.95,0
EIA6032-28/C-R = smd 2.55 x 2.5: + 2.525,0; - -2.525,0
C1210 = smd 1.6 x 2.7: 1 -1.4,0; 2 1.4,0
DO214AC = smd 1.8 x 1.7: A 2.05,0; C -2.05,0
TO92-LINE = drill 0.9: 1 -2.54,0; 2 0,0; 3 2.54,0
TSOT23-6 = smd 0.62 x 1.22: 1 -0.95,-1.3; 2 0,-1.3; 3 0.95,-1.3; 4 0.95,1.3; 5 0,1.3; 6 -0.95,1.3
MSOP08 = smd 0.3 x 1.2: 1 -0.976,-2.113; 2 -0.326,-2.113; 3 0.324,-2.113; 4 0.974,-2.113; 5 0.974,2.112; 6 0.324,2.112; 7 -0.326,2.112; 8 -0.976,2.112
SO16 = smd 0.66 x 2.032: 1 -4.445,-3.073; 2 -3.175,-3.073; 3 -1.905,-3.073; 4 -0.635,-3.073; 5 0.635,-3.073; 6 1.905,-3.073; 7 3.175,-3.073; 8 4.445,-3.073; 9 4.445,3.073; 10 3.175,3.073; 11 1.905,3.073; 12 0.635,3.073; 13 -0.635,3.073; 14 -1.905,3.073; 15 -3.175,3.073; 16 -4.445,3.073
SRR6038 = smd 2.591 x 7.29: 1 -2.349,0; 2 2.349,0
CHIPLED_0805 = smd 1.2 x 1.2: A 0,-1.05; C 0,1.05
SUPER-SOT3 = smd 1 x 1.4: 1 -0.95,-1.1; 2 0.95,-1.1; 3 0,1.1
M0805 = smd 1.3 x 1.6: 1 -0.95,0; 2 0.95,0
_2818 = smd 3.5 x 5.1: 1 -2.286,0; 2 2.286,0
SJ_2 = smd 1.168 x 1.6: 1 -1.524,0; 2 0,0; 3 1.524,0
SOLDERJUMPER_ARROW_NOPASTE = smd 0.762 x 1.524: 1 -1.016,0; 2 1.016,0
PWP20_2P4X3P4 = smd 1.27 x 0.305: 1 -2.972,2.921; 2 -2.972,2.286; 3 -2.972,1.626; 4 -2.972,0.965; 5 -2.972,0.33; 6 -2.972,-0.33; 7 -2.972,-0.965; 8 -2.972,-1.626; 9 -2.972,-2.286; 10 -2.972,-2.921; 11 2.972,-2.921; 12 2.972,-2.286; 13 2.972,-1.626; 14 2.972,-0.965; 15 2.972,-0.33; 16 2.972,0.33; 17 2.972,0.965; 18 2.972,1.626; 19 2.972,2.286; 20 2.972,2.921 | smd 2.388 x 3.404: 21 0,0
SOP65P640X120-29N = smd 1.473 x 0.356: 1 -2.819,4.216; 2 -2.819,3.581; 3 -2.819,2.921; 4 -2.819,2.286; 5 -2.819,1.626; 6 -2.819,0.965; 7 -2.819,0.33; 8 -2.819,-0.33; 9 -2.819,-0.965; 10 -2.819,-1.626; 11 -2.819,-2.286; 12 -2.819,-2.921; 13 -2.819,-3.581; 14 -2.819,-4.216; 15 2.819,-4.216; 16 2.819,-3.581; 17 2.819,-2.921; 18 2.819,-2.286; 19 2.819,-1.626; 20 2.819,-0.965; 21 2.819,-0.33; 22 2.819,0.33; 23 2.819,0.965; 24 2.819,1.626; 25 2.819,2.286; 26 2.819,2.921; 27 2.819,3.581; 28 2.819,4.216 | smd 2.743 x 4.75: 29 0,0

### Placement (x,y rotation side)
+X  8.26,74.93 270 top
+Y  8.26,44.45 270 top
-X  8.26,59.69 270 top
-Y  8.26,29.21 270 top
BACKUP1  78.74,41.91 270 top
BAT  57.1,8.89 270 top
C1  22.81,39.32 0 top
C21  28.07,3.45 90 top
C22  28.83,11.3 90 top
C23  35.56,4.13 180 bottom
C24  50.8,8.89 90 top
C27  63.63,5.08 270 top
C40  50.01,75.97 270 bottom
C41  33.27,68.83 180 top
C42  33.3,64.29 180 top
C43  33.27,66.55 180 top
C44  37.85,66.67 180 bottom
C45  39.5,56.54 180 bottom
C46  59.21,52.88 90 bottom
C47  63.37,53.47 270 top
C48  69.93,72.11 90 top
C49  72.9,72.09 270 top
C50  66.67,53.98 90 top
C51  47.12,78.79 270 top
C52  36.07,85.09 0 top
C53  36.45,81.92 180 top
C54  68.83,40.51 90 top
C55  72.14,40.26 270 top
C63  45.72,12.95 270 top
C64  25.78,12.45 90 top
C72  13.34,78.74 180 bottom
C73  15.24,76.83 0 top
C74  15.24,13.34 90 bottom
C75  13.65,63.18 180 bottom
C76  15.56,61.28 0 top
C77  13.34,46.35 180 bottom
C78  15.24,44.45 0 top
C79  13.34,31.11 180 bottom
C80  15.24,29.21 0 top
D1  58.98,49.61 270 top
D2  59.11,56.16 90 top
D3  66.4,72.62 270 top
D4  50.67,78.23 270 top
D5  45.8,73.61 180 top
D6  14.29,32.38 180 top
D7  14.29,47.62 180 top
D8  14.61,64.45 180 top
D9  14.61,80.01 180 top
FOTOCELULA  24.13,3 0 top
IC10  58.42,3.81 180 top
IC12  13.34,81.92 0 bottom
IC13  12.06,13.02 0 bottom
IC14  13.34,66.36 0 bottom
IC15  13.02,49.53 0 bottom
IC16  13.02,34.29 0 bottom
IC17  31.75,36.83 0 top
L5  53.7,50.8 90 top
L6  61.32,72.64 180 top
L7  41.83,79.58 270 top
LED4  52.7,3.81 0 top
LED5  49.53,3.81 0 top
Q4  12.56,85.69 90 top
Q5  12.56,69.85 90 top
Q6  12.57,53.45 90 top
Q7  11.96,37.96 90 top
R14  40.51,52.1 90 top
R15  33.78,70.87 180 bottom
R17  38.23,52.15 90 top
R18  42.82,52.1 90 top
R45  35.18,14.61 0 top
R54  9.53,14.61 180 top
R55  13.65,14.61 0 top
R59  35.86,70.87 0 top
R60  50.04,80.31 270 bottom
R61  33.73,66.8 180 bottom
R62  35.36,56.67 180 bottom
R65  63.75,51.18 90 bottom
R66  63.68,55.37 90 bottom
R67  69.95,74.42 270 bottom
R68  69.82,70.38 270 bottom
R69  39.75,80.64 180 bottom
R70  43.94,80.7 180 bottom
R78  13.65,12.38 180 top
R79  13.65,16.83 180 top
R80  9.53,16.83 180 top
R81  9.53,12.38 180 top
R82  19.37,15.88 270 top
R83  31.11,6.35 0 bottom
R84  35.56,6.35 0 bottom
R85  52.7,5.08 270 bottom
R86  49.53,5.08 270 bottom
SJ1  36.83,2.54 180 top
SJ2  41.91,2.54 180 top
SJ3  31.78,2.51 180 top
SJ6  31.11,28.57 0 bottom
SJ7  31.11,3.81 180 bottom
U3  40.64,7.62 0 top
U5  43.81,61.21 270 top
U$2  [LOGO_MAUA]  75.93,65.86 90 bottom
U$112  [LOGO_MAUA]  80.76,65.79 90 top

### Tracks (layer width: path | path; a pad name or v marks a point on that pad's centre or on a via)
+VFOTO_CELL_+X  (via drill 0.6)
  Top 0.406: D9.A 13.02,80.01 v14.62,78.64
  Top 0.813: D9.A 11.64,80.09
  Top 1.016: Q4.3 11.46,80.44 11.89,80.01
  Top 1.27: D9.A 11.89,80.01 +X.1
  Bottom 0.406: IC12.1 14.29,80.01 v14.62,78.64
  Bottom 1.27: C72.2 14.51,78.74 v14.62,78.64
+VFOTO_CELL_+Y  (via drill 0.6)
  Top 0.406: 12.24,48.62 12.24,48.4 C77.2
  Top 0.813: D7.A 12.24,47.35
  Top 1.016: Q6.3 11.47,49.57 11.43,49.53
  Top 1.27: +Y.1 11.43,49.53 12.24,48.62 12.24,47.35
  Bottom 0.406: IC15.1 13.97,46.67 C77.2 14.29,46.67 14.61,46.99
  other vias: 14.29,46.35
+VFOTO_CELL_-X  (via drill 0.6)  (1 unrouted)
  Top 0.406: 12.55,65.09 12.7,65.09 v14.83,63.18
  Top 0.813: D8.A 12.55,65.09
  Top 1.016: Q5.3 11.46,65.55 D8.A
  Top 1.27: -X.1 12.55,64.77 D8.A
  Bottom 0.406: 14.61,63.5 14.6,63.5 v14.83,63.18 14.29,63.5 IC14.1
+VFOTO_CELL_-Y  (via drill 0.6)
  Top 0.406: D6.A 13.02,32.38 C79.2
  Top 0.61: D6.A
  Top 1.016: Q7.3 10.92,33.75 10.16,34.29
  Top 1.27: -Y.1 10.16,34.29 10.41,34.29 D6.A
  Bottom 0.406: C79.2 14.29,31.43 13.97,31.75 IC16.1
  other vias: 14.29,31.11
AD_IOUT_VCELL  (via drill 0.6)
  Top 0.305: v13.97,9.53 14.61,10.48 R78.1
  Top 0.406: R78.1 14.6,10.34 13.72,9.45 v17.07,9.45
  Top 0.61: 32.38,20.95 29.97,18.54 v24.99,18.54
  Top 0.762: IC17.5 32.38,20.95
  Bottom 0.305: IC13.1 13.04,10.14 v13.97,9.53
  Bottom 0.406: v17.07,9.45 17.07,17.78
  Bottom 0.61: v24.99,18.54 17.83,18.54 17.07,17.78
  Bottom 0.762: 17.88,18.59 17.07,17.78
AD_TEMP_BAT  (via drill 0.6)
  Top 0.762: IC17.2 28.57,20.95 v27.94,20.32
  Bottom 0.406: 27.94,8.89 27.94,5.08 29.21,3.81 SJ7.1 29.84,3.56 29.84,1.27 30.48,0.74 57,0.71 58.42,2.06 IC10.2
  Bottom 0.762: v27.94,20.32 27.94,8.89
AD_VOUT_VCELL  (via drill 0.6)
  Top 0.762: IC17.1 26.14,33.76 25.4,33.02 25.4,29.52 v21.89,26.01 | v12.75,22.55 12.7,22.2 v12.7,19.15
  Bottom 0.305: IC13.7 IC13.6
  Bottom 0.406: IC13.7 12.39,16.2 12.7,16.51 v12.7,19.15
  Bottom 0.762: v21.89,26.01 21.95,25.91 21.44,25.4 13.46,25.4 12.8,24.69 12.75,24.64 v12.75,22.55
AUX  (via drill 0.6)
  Top 0.61: v26.67,25.4 26.67,30.33 v27.13,30.79 | v5.49,38.41 v5.49,46.89
  Bottom 0.61: v27.13,30.79 27.13,39.62 26.21,40.54 13.41,40.54 9.75,37.49 6.4,37.49 v5.49,38.41 | IC15.3 11.51,48.23 10.67,49.07 10.67,50.9 10.06,51.51 6.1,51.51 5.49,50.9 v5.49,46.89 | BACKUP1.24 78.74,31.75 74.12,31.75 67.67,25.3 26.77,25.3 v26.67,25.4
AUX_1  (via drill 0.6)
  Top 0.61: IC17.11 33.66,41.88 34.75,42.98 37.8,42.98 38.71,42.06 38.71,38.71 40.54,36.88 40.54,22.05 v41.6,20.98
  Bottom 0.61: BACKUP1.28 78.74,26.67 75.54,26.67 69.85,20.98 v41.6,20.98
AUX_2  (via drill 0.6)
  Top 0.61: IC17.10 34.92,41.27 35.56,41.91 37.03,41.91 37.49,41.45 37.49,38.1 39.32,36.27 39.32,20.73 v40.34,19.71
  Bottom 0.61: BACKUP1.30 78.74,24.13 75.84,24.13 71.73,19.71 v40.34,19.71
AUX_3  (via drill 0.6)
  Top 0.61: IC17.9 36.2,37.47 38.1,35.56 38.1,19.41 v39.06,18.44
  Bottom 0.61: BACKUP1.32 80.01,20.98 77.47,18.44 v39.06,18.44
AUX_4  (via drill 0.6)
  Top 0.61: v5.38,31.5 5.38,23.93 6.76,22.25 10.06,22.25 11.89,24.08 15.85,24.08 16.46,23.47 16.46,22.25 v17.07,21.64
  Bottom 0.356: IC16.3 6.17,32.99 6.1,32.92 5.42,31.47 v5.38,31.5
  Bottom 0.61: BACKUP1.27 74.93,27.94 69.19,22.2 17.73,22.2 17.12,21.59 17.02,21.59 v17.07,21.64
AUX_6  (via drill 0.6)
  Top 0.61: v5.18,53.65 5.18,62.13 v5.08,62.23
  Bottom 0.61: IC14.3 11.14,65.06 9.75,66.75 6.4,66.75 5.18,65.53 5.18,62.64 | 5.18,62.64 5.18,62.48 5.08,62.38 v5.08,62.23 5.18,62.64 | BACKUP1.22 78.74,34.29 73,34.29 66.75,28.04 37.19,28.04 36.27,28.96 36.27,36.27 28.65,43.89 23.16,43.89 21.03,46.02 21.03,51.51 18.29,54.25 12.8,54.25 11.28,52.73 6.1,52.73 v5.18,53.65
AUX_7  (via drill 0.6)
  Top 0.61: v5.18,69.19 5.18,77.11 5.79,78.03 5.79,80.47 7.01,81.99 v9.75,81.99
  Bottom 0.61: BACKUP1.21 72.44,35.56 66.14,29.26 38.71,29.26 37.49,30.48 37.49,36.58 28.96,45.11 25.91,45.11 24.99,46.02 24.99,52.02 19.51,57.51 19.51,69.19 17.98,70.71 12.8,70.71 11.58,69.49 11.58,68.89 10.67,67.97 6.4,67.97 v5.18,69.19 | IC12.3 11.43,80.61 11.28,80.47 v9.75,81.99
BOOST1  (via drill 0.6)
  Top 0.356: v47.57,82.04 47.57,80.72 47.32,80.47 47.19,80.27 C51.1
  Top 0.406: U5.5 45.44,70.76 v44.22,71.65
  Top 0.61: D4.C 47.21,80.28 C51.1
  Bottom 0.356: 46.58,80.31 v47.57,82.04
  Bottom 0.406: 46.58,80.31 46.58,72.26 46.35,72.03 45.09,72.03 45.09,71.96 v44.22,71.65
FB1  (via drill 0.6)
  Top 0.406: U5.8 43.48,66.98 40.39,70.08 v40.39,73.18
  Bottom 0.356: 42.94,80.64 41.27,80.64 40.64,80.01 40.59,73.41 40.44,73.18 v40.39,73.18
  Bottom 0.61: R69.2 42.94,80.64 R70.1
FB2  (via drill 0.6)
  Top 0.406: U5.11 41.53,65.89 40.39,67.03 38.25,67.03 37.64,67.64 v37.64,68.56
  Bottom 0.406: v37.64,68.56 31.24,68.56 29.41,66.73 29.41,54.53 33.96,49.99 47.55,49.99 49.38,51.82 49.38,55.17 50.29,56.08 52.12,56.08 53.19,57.15 54.61,57.15 55.88,55.88 60.96,55.88 62.23,54.61 63.68,54.61 R66.1
  Bottom 0.61: R66.1 63.68,52.21 R65.2
FB3  (via drill 0.6)
  Top 0.406: U5.19 U5.20 42.85,56.82 42.67,56.39 v42.52,56.39 | v54.61,58.42 62.23,66.04 64.14,66.04 66.04,67.94 v66.04,68.58
  Bottom 0.406: v42.52,56.39 46.33,56.39 47.55,57.61 52.12,57.61 52.7,58.42 v54.61,58.42 | 69.94,73.46 R67.2 | v66.04,68.58 68.79,71.33 R68.1
  Bottom 0.61: R68.1 69.83,73.34 R67.2
GND  (via drill 0.6)
  Top 0.305: v33.55,2.39 33.43,2.39 SJ3.1
  Top 0.406: R80.2 6.03,16.83 5.71,16.51 | 5.71,16.51 5.71,12.7 6.03,12.38 R81.2 8.57,10.47 v8.89,10.16 | 38.1,2.79 38.1,3.81 37.62,4.29 37.67,4.14 36.63,4.14 36.25,4.52 36.42,4.7 U3.10 36.32,4.7 | 38.1,2.79 SJ1.1 | C64.1 25.78,9.14 26.04,8.89 | 26.04,8.89 28.72,8.89 C22.- 29.21,8.4 v28.96,6.35 | 26.04,8.89 25.4,8.26 FOTOCELULA.2 25.72,2.86 C21.1 | 55.91,7.54 BAT.2 51.12,7.62 C24.1 48.25,7.95 U3.16 40.97,7.95 U3.21 40.54,7.72 v41.81,8.76 41.1,9.17 | C27.1 61.39,7.59 55.91,7.54 | 55.91,7.54 IC10.3 | SJ2.1 45.09,2.54 v45.72,1.91 | 41.12,4.93 41.6,4.45 v41.73,4.45 39.75,4.7 36.35,4.72 36.32,4.7 | 41.12,4.93 41.12,6.33 | 41.12,6.33 40.87,6.58 40.95,7.01 41.12,6.86 41.12,6.33 | 41.12,4.93 41.1,4.88 40.26,4.88 40.21,4.98 40.21,6.81 40.72,7.37 v41.76,7.37 | 36.3,4.7 36.32,4.7 | C63.1 43.77,13.9 42.67,12.8 42.67,11.89 41.45,10.67 41.45,10.06 41.1,10.06 41.1,9.98 40.13,9.98 40.13,9.2 40.16,9.17 41.07,9.17 41.1,9.14 41.1,9.17 | 41.1,9.91 41.1,9.17 | 38.1,2.79 v38.41,1.83 | C41.2 C43.2 32.32,64.71 31.75,64.14 32.2,64.14 C42.2 32.38,64.25 32.38,62.23 v33.4,60.58 U5.29 44.7,60.33 46.35,60.33 46.74,59.94 U5.26 | v42.01,74.14 34.85,74.14 30.42,71.67 | BACKUP1.19 BACKUP1.17 BACKUP1.18 BACKUP1.20 BACKUP1.19 | BACKUP1.19 76.2,36.83 67.31,36.83 66.67,37.47 66.67,39.24 67.06,39.62 74.98,39.62 75.89,40.54 77.42,40.54 | -X.2 6.99,62.23 5.71,63.5 5.71,67.31 +X.5 8.89,69.85 10.79,71.75 10.79,75.56 12.06,76.83 | 12.7,44.45 11.43,43.18 11.43,41.91 8.89,39.37 +Y.5 6.04,37.16 6.04,32.66 6.71,32 7.39,31.7 -Y.2 | 11.43,62.23 12.7,60.96 12.7,57.15 10.79,55.24 10.16,55.24 9.53,54.61 -X.5 8.26,53.98 6.35,52.07 6.35,52.02 5.71,51.38 5.71,48.62 7.01,47.24 7.19,47.07 8.18,47.07 8.18,46.99 7.92,46.94 8.2,46.94
  Top 0.406: 8.23,46.94 8.2,46.94 | 8.2,46.94 +Y.2 | 12.7,29.21 12.7,27.3 9.53,24.13 -Y.5 | v4.57,22.55 4.57,17.68 5.16,17.07 5.71,16.51
  Top 0.61: C50.2 v66.67,56.52 66.15,55.99 C47.- 63.37,57.28 62.44,58.21 D2.A | v42.01,74.14 43.21,74.14 D5.A | C73.1 12.06,76.83 11.43,77.47 +X.2 | C76.1 12.38,61.28 11.43,62.23 -X.2 | C78.1 12.7,44.45 11.43,45.72 10.16,45.72 8.89,46.99 +Y.2 | C80.1 12.7,29.21 10.16,31.75 -Y.2 | v21.89,37.49 21.89,39.28 C1.1 | IC17.6 33.66,35.53 33.22,35.97 25.3,35.97 v23.77,34.44
  Top 0.762: IC17.8 36.2,31.11 35.56,30.48 v34.29,30.48 | IC17.7 34.92,31.11 v34.29,30.48 | IC17.6 33.66,31.11 v34.29,30.48
  Top 1.422: C49.2 72.9,69.9 72.24,69.24 70.27,69.24 | 70.27,69.24 C48.- | v69.85,67.31 69.85,68.82 70.27,69.24
  Bottom 0.305: C79.1 12.07,31.12
  Bottom 0.406: 12.7,31.75 12.7,31.43 C79.1 10.79,31.12 | IC13.4 11.09,10.46 10.79,10.16 v8.89,10.16 8.84,10.11 8.84,7.92 9.45,7.32 14.02,7.32 15.16,7.67 C74.1 | C77.1 12.38,46.67 13.02,47.31 IC15.2 | IC14.2 13.34,64.14 12.7,63.5 C75.1 | IC12.2 13.34,80.01 12.7,79.38 12.7,79.06 C72.1 | C23.1 34.29,3.81 34.29,2.54 33.66,1.91 33.02,1.91 33.4,1.52 38.1,1.52 v38.41,1.83 | v45.72,1.91 46.35,2.54 46.35,3.99 46.63,4.27 46.63,6.1 46.02,6.71 41.76,6.71 v41.73,4.45 | v41.76,7.37 40.54,7.52 U3.21 40.64,9.04 v41.81,8.76 | R83.2 v28.96,6.35 | R70.2 44.89,82.36 45.72,83.19 49.53,83.19 50.16,82.55 50.16,81.39 R60.1 | IC16.2 13.02,32.07 12.7,31.75 | 12.7,31.75 12.06,31.11 12.32,30.5 12.32,29.57 12.68,29.21 17.14,29.21 17.78,29.84 17.78,31.5 21.95,35.66 | -Y.5 5.66,24.13 4.45,22.38 v4.57,22.55 | v33.4,60.58 33.4,57.67 R62.1
  Bottom 0.61: R66.2 66.48,56.32 v66.67,56.52 | R70.2 44.89,79.18 43.18,77.47 43.18,74.7 42.62,74.14 v42.01,74.14 | C72.1 12.38,78.42 11.43,77.47 +X.2 | C75.1 12.38,63.19 11.43,62.23 -X.2 | C77.1 8.89,46.35 +Y.2 | 10.79,31.12 10.16,31.75 -Y.2 | 15.16,7.67 21.87,7.67 25.4,5.08 FOTOCELULA.2 | v23.77,34.44 23.16,34.44 21.95,35.66 21.95,37.44 v21.89,37.49
  Bottom 0.762: SJ6.1 33.66,28.57 34.29,29.21 v34.29,30.48
  Bottom 1.422: R68.2 69.83,67.33 v69.85,67.31
  other vias: 46.1,60.58 46.1,61.85 44.83,61.85 43.56,61.85 42.29,61.85 41.02,61.85 39.75,61.85 38.48,61.85 37.21,61.85 44.83,60.58 43.56,60.58 42.29,60.58 41.02,60.58 39.75,60.58 38.48,60.58 37.21,60.58 35.94,60.58 34.67,60.58 32.13,60.58 30.86,61.21 35.94,61.85 34.67,61.85 33.4,61.85 32.13,61.85 30.86,62.48 39.75,4.45 39.8,5.87 39.83,7.34 39.8,8.79 39.78,10.26 41.86,10.29 41.76,5.87
  pour Top (isolate 0.406, rank 3): 0.64,-1.27 83.19,-1.27 83.19,90.17 -0.64,90.17 -0.64,-1.27
  pour Bottom (isolate 0.254, rank 3): 0.64,-1.27 83.19,-1.27 83.19,90.17 -0.64,90.17 -0.64,-1.27
MUX_AD  (via drill 0.6)
  Top 0.762: IC17.3 29.84,27.3 v30.48,26.67
  Bottom 0.762: v30.48,26.67 67.31,26.67 73.66,33.02 BACKUP1.23
N$1
  Top 0.305: U3.8 35.26,6.02 34.27,5.03 34.27,4.52 33.81,4.06 32.23,4.06 31.75,3.58 SJ3.2
N$2  (via drill 2)
  other vias: 3.17,79.69
N$3  (via drill 2)
  other vias: 79.38,9.84
N$4  (via drill 2)
  other vias: 3.17,9.84
N$5  (via drill 2)
  other vias: 79.38,79.69
N$19
  Top 0.406: U5.17 40.89,53.4 R14.2
N$21
  Top 0.406: U5.16 40.23,55.55 38.71,54.05 38.71,53.6 R17.2
N$27
  Top 0.406: U5.21 43.48,53.71 R18.2
N$29
  Top 0.406: U5.9 42.85,66.5 39.57,69.77 37.91,69.77 R59.2
N$33  (via drill 0.6)
  Top 0.406: U3.2 36.45,9.91 | 36.45,9.91 36.51,10.16 v34.92,10.16 | U3.3 36.47,9.25 | 36.47,9.25 36.51,9.84 36.51,9.97 36.45,9.91 | 36.47,9.25 35.92,11.91 39.06,11.91 38.73,14.22 R45.2 | U3.5 35.55,7.95 v34.92,7.94 36.52,7.95 U3.5
  Bottom 0.406: v34.92,7.94 v34.92,10.16
  pour Top: 38.3,9.12 38.3,10.01 36.63,10.01 36.63,11.1 37.08,11.56 39.6,11.56 39.6,12.4 39.6,17.55 35.48,17.55 35.48,11.81 35.48,9.7 35.86,9.7 36.42,9.14 38.28,9.14
N$38
  Top 0.406: SJ2.2 41.91,3.17 42.55,3.81 46.04,3.81 46.67,4.45 46.67,5.4 46.08,5.99 U3.13
N$46
  Top 0.305: U3.9 35.76,5.33 35.48,5.03 35.48,4.14 36.47,3.45 36.5,3.28
  Top 0.406: SJ1.2 36.5,3.28
N$48  (via drill 0.6)
  Top 0.406: v45.43,4.83 44.83,5.33 U3.12
  Bottom 0.406: C23.2 R84.1 36.51,4.76 36.83,4.45 36.83,3.17 37.16,2.85 45.12,2.87 45.44,3.19 v45.43,4.83
N$54  (via drill 0.6)
  Top 0.406: U5.6 44.78,69.32 v44.35,69.77
  Bottom 0.406: R15.2 35.22,70.38 35.24,70.41 43.28,70.41 43.92,69.77 v44.35,69.77
N$55
  Top 0.406: U5.12 40.89,65.61 40.08,66.42 37.34,66.42 36.73,67.03 36.73,67.94 35.81,68.86 34.25,68.86 C41.1
N$56
  Top 0.406: U5.13 40.23,65.35 39.78,65.81 36.12,65.81 35.51,66.42 34.35,66.42 C43.1
N$57
  Top 0.406: U5.14 34.5,64.03 C42.1
N$59  (1 unrouted)
N$62  (via drill 0.6)
  Top 0.406: U5.10 42.19,66.14 40.39,67.94 v39.17,68.3
  Bottom 0.406: v39.17,68.3 39.17,67.31 38.96,67.11 38.86,66.74 C44.2
N$63  (via drill 0.6)
  Top 0.406: U5.18 41.5,55.42 42.06,54.86 v42.22,54.84
  Bottom 0.406: v42.22,54.84 42.22,54.69 40.47,56.52 C45.2
N$67
  Bottom 0.406: R61.2 36.77,66.8 C44.1
N$68
  Bottom 0.406: R62.2 37.95,56.67 38.1,56.52 38.52,56.52 C45.1
N$69  (via drill 0.6)
  Top 0.406: U5.7 44.15,67.61 42.88,68.89 v42.88,69.22
  Bottom 0.406: v42.88,69.22 43.79,68.28 47.93,68.28 50.01,70.97 C40.2
N$70  (via drill 0.6)
  Top 0.406: U5.24 45.44,56.36 47.24,54.56 48.84,54.56 49.53,55.24 53.34,55.24 v53.98,55.88 | D1.C 60.56,51.66 v60.73,51.56
  Bottom 0.406: v53.98,55.88 54.61,55.24 54.61,53.34 56.02,51.93 C46.1 59.76,51.56 v60.73,51.56
N$74  (via drill 0.6)
  Top 0.406: v15.44,84.48 15.14,84.58 Q4.1
  Bottom 0.406: IC12.5 13.34,84.45 v15.44,84.48
N$75  (via drill 0.6)
  Top 0.406: R80.1 v11.43,16.83 R79.2
  Bottom 0.305: IC13.5 11.09,16.49 v11.43,16.83
N$76  (via drill 0.6)
  Top 0.305: R55.1 R78.2 12.38,12.06 12.38,9.21 v12.7,8.57
  Bottom 0.305: IC13.2 12.39,9.22 v12.7,8.57
N$77  (via drill 0.6)
  Top 0.305: v11.11,8.89 11.11,9.21 10.48,9.84 R81.1
  Top 0.406: R54.1 R81.1
  Bottom 0.305: IC13.3 11.74,9.84 11.11,9.21 v11.11,8.89
N$78  (via drill 0.6)
  Top 0.406: R54.2 v7.3,14.61 | v6.68,18.1 19.3,18.1 R82.1 | v15.88,67.31 16.82,67.31 | v15.88,82.55 17.12,82.55 | v15.24,50.8 16.79,50.8 | v15.24,35.56 16.51,35.56
  Top 0.61: 16.51,32.56 16.51,35.56 16.51,37.64 15.25,38.9 | 16.51,32.56 D6.C 16.19,32.38 C80.2 | 16.51,32.56 16.51,32.38
  Top 0.813: 16.17,86.22 17.12,85.27 17.12,82.55 17.12,80.16 D9.C 16.19,79.55 C73.2 | C78.2 16.19,47.62 D7.C 16.79,48.39 16.79,50.8 16.79,53.21 16.86,53.39 15.56,54.45 | 15.85,70.66 16.82,69.7 16.82,67.31 16.82,64.6 D8.C arc90 16.51,64.31 C76.2 16.51,61.91
  Top 1.016: Q7.2 15.25,38.9 | Q6.2 15.84,54.4 16.86,53.39 | Q5.2 15.71,70.8 15.85,70.66 | Q4.2 15.75,86.64 17.12,85.27
  Top 1.27: C73.2 17.78,76.83 18.41,76.2
  Top 1.422: R82.1 19.37,32.38 | 19.37,32.38 19.37,44.45 | 19.37,44.45 19.37,64.14 | 19.37,64.14 19.37,78.42 17.78,80.01 D9.C | 18.41,76.2 19.05,75.56 | 19.37,64.14 16.51,64.14 16.51,64.13 C76.2 18.73,61.28 19.05,60.96 | 19.37,44.45 C78.2 16.19,47.3 16.51,47.62 19.05,47.62 | 16.51,32.38 19.37,32.38
  Bottom 0.406: v7.3,14.61 7.3,17.46 6.67,18.1 v6.68,18.1 | IC14.6 15.53,67.66 v15.88,67.31 | IC12.6 15.21,83.22 v15.88,82.55 | IC15.6 15.21,50.83 v15.24,50.8 | IC16.6 15.21,35.59 v15.24,35.56
N$79  (via drill 0.6)
  Top 0.762: IC17.4 31.11,30.81 v31.09,30.79
  Bottom 0.762: v31.09,30.79 31.09,28.6 SJ6.2
N$80  (via drill 0.6)
  Top 0.406: v52.7,1.91 LED4.A
  Bottom 0.406: R85.2 v52.7,1.91
N$81  (via drill 0.6)
  Top 0.406: v15.19,69.09 14.8,69.09 Q5.1
  Bottom 0.406: IC14.5 13.34,68.91 13.72,69.19 v15.19,69.09
N$82  (via drill 0.6)
  Top 0.406: v15.14,52.7 14.53,52.51 Q6.1
  Bottom 0.406: IC15.5 13.02,52.08 13.72,52.73 v15.14,52.7
N$83  (via drill 0.6)
  Top 0.406: Q7.1 14.43,37.01 v14.55,37.19
  Bottom 0.406: IC16.5 13.02,36.96 Q7.1 13.41,37.19 v14.55,37.19
N$84  (via drill 0.6)
  Top 0.406: U3.7 34.63,6.66 v34.28,6.4
  Bottom 0.406: v34.28,6.4 R83.1 32.06,3.88 SJ7.2
  Bottom 1.27: R84.2 34.33,6.35 v34.28,6.4
N$86  (via drill 0.6)
  Top 0.406: LED5.A v49.53,1.91
  Bottom 0.406: v49.53,1.91 R86.2
N$87
  Top 0.406: U3.14 46.69,6.66 47.31,6.03 47.94,6.03 49.53,5.08 LED5.C
N$88
  Top 0.406: U3.15 48.27,7.29 49.21,6.35 50.8,6.35 52.7,5.08 LED4.C
SENSOR_+X  (via drill 0.6)
  Top 0.762: IC17.13 31.11,43.16 24.13,50.34 24.13,69.85 v22.86,71.12
  Bottom 0.762: v22.86,71.12 21.59,72.39 +X.4
SENSOR_+Y  (via drill 0.6)
  Top 0.762: IC17.15 28.57,41.27 27.94,41.91 v22.86,41.91
  Bottom 0.762: +Y.4 20.32,41.91 v22.86,41.91
SENSOR_-X  (via drill 0.6)
  Top 0.762: v22.86,48.87 29.84,41.94 IC17.14
  Bottom 0.762: -X.4 17.78,57.15 22.86,52.07 v22.86,48.87
SENSOR_-Y  (via drill 0.6)
  Top 0.762: v21.59,27.94 21.59,34.29 25.09,37.8 31.7,37.8 32.38,38.48 IC17.12
  Bottom 0.762: -Y.4 20.32,26.67 v21.59,27.94
SW1
  Top 0.406: U5.3 46.74,67.03 46.47,67.3 46.47,65.75 46.08,65.36 46.08,64.11 46.72,64.11 46.72,64.03 U5.4
  Top 0.61: C51.2 45.8,77.39 44.45,77.47 44.45,78.27 L7.2
  pour Top (isolate 0.025): 46.35,64.14 46.2,64.14 46.08,64.32 46.08,75.08 45.95,75.29 38.2,75.29 37.39,76.3 37.41,78.18 38.4,78.64 48.16,78.64 48.77,78.03 48.77,72.85 48.46,72.54 48.16,72.54 47.85,72.24 47.85,68.28 46.63,67.06 46.63,64.31 46.33,64.01
SW2  (via drill 0.6)
  Top 0.406: U5.23 44.78,55.88 47.32,53.34 53.51,53.34 L5.2
  Top 0.61: v60.76,53.98 60.19,54.11 D2.C 54.49,54.06 L5.2
  Bottom 0.61: v60.76,53.98 59.35,53.98 C46.2
SW3
  Top 0.406: U5.27 47.4,57.45 47.85,57 50.29,57 60.78,67.49 63.68,67.49 64.14,67.94 64.14,69.85 64.94,70.65
  Top 1.422: D3.A 65.02,70.57 64.94,70.65 64.47,71.12 63.86,71.54 L6.1
  pour Top: 67.41,71.45 64.9,71.45 64.9,76.86 62.2,76.86 62.2,68.78 61.62,68.78 59.28,66.45 59.26,66.45 50.24,57.43 50.01,57.2 48.01,57.2 47.75,56.95 47.75,56.79 47.9,56.64 51.28,56.64 61.57,66.93 63.98,66.93 65.02,67.97 65.02,69.09 65.53,69.6 67.26,69.6 67.41,69.6
VBAT  (via drill 0.6)
  Top 0.203: 47.45,64.08 U5.2
  Top 0.406: U3.19 44.83,9.91 | 44.83,9.91 45.09,10.16 | U3.18 44.81,9.25 45.09,9.53 | U3.17 44.78,8.59 45.09,8.89 45.09,9.53 | 45.09,9.53 45.09,9.65 44.83,9.91 | 45.09,10.16 47.62,10.16 | 47.62,10.16 47.94,10.16 | 47.62,10.16 47.95,9.84 C24.2 51.12,10.16 BAT.1 | 45.09,10.16 45.09,11.37 C63.2 | 40.56,51.2 R17.1 38.22,51.21 37.19,51.21 36.58,51.82 36.58,54.56 37.19,55.17 38.41,55.17 39.6,56.36 U5.15 39.57,58.42 v37.47,58.42 31.11,58.42 28.55,60.98 28.52,69.77 29.59,70.87 R15.1 R59.1 | 40.56,51.2 42.77,51.2 R18.1 42.84,51.16 43.87,51.16 43.98,51.27 44.48,51.44 | 40.56,51.2 R14.1 | BACKUP1.15 BACKUP1.13 | BACKUP1.14 BACKUP1.16 BACKUP1.15 | BACKUP1.15 76.2,43.18 74.3,41.27 72.2,41.27 | 72.2,41.27 71.12,41.27 69.36,43.04 C54.+ 67.67,44.2 v67.67,45.72 68.28,46.33 79.55,46.33 79.86,46.02 79.86,43.28 77.42,43.28 | 72.2,41.27 C55.1 | U5.22 44.15,54.3 44.48,53.98 44.48,51.44 | U5.25 46.1,56.92 47.24,55.78 v47.85,55.78 | v45.72,52.07 44.48,51.44 | U5.28 48.23,58.4 48.9,59.05 v49.73,59.33 49.53,59.69 49.53,63.5 48.9,64.14 48.26,64.14 48.16,64.03 | U5.1 47.73,64.03 | 47.62,64.14 47.47,64.14 47.42,63.83 | 47.42,63.83 47.42,65.61 47.44,64.84 | 47.42,63.83 47.45,64.08
  Bottom 0.406: v47.85,55.78 47.85,52.96 46.35,52.07 v45.72,52.07 | v49.73,59.33 48.9,59.05 48.26,58.42 v37.47,58.42 | BACKUP1.15 77.47,42.98 80.16,42.98 80.16,45.72 | 80.16,45.72 80.16,46.02 77.11,46.02 77.11,42.98 77.42,42.98 77.42,43.18 BACKUP1.15 | BACKUP1.15 BACKUP1.16 BACKUP1.14 | BACKUP1.14 80.16,45.72 | BACKUP1.14 BACKUP1.13 BACKUP1.15 | v67.67,45.72 67.92,46.28 67.92,59.61 51.44,59.69 48.26,59.69 48.26,66.67 50.16,68.58 60.33,68.58 63.5,65.41 67.31,65.41 70.92,62.23 70.92,46.3 70.48,45.72 69.85,45.09 | R15.1 32.58,71.12 32.38,71.12 32.64,70.87 R15.1
  other vias: 68.94,45.72 70.21,45.72 71.48,45.72 72.75,45.72 74.02,45.72 75.29,45.72 75.29,44.45 75.29,43.18 74.02,44.45 74.02,43.18 72.75,44.45 72.75,43.18 71.48,44.45 71.48,43.18 74.02,41.91 68.94,44.45 70.21,44.45 67.67,44.45 67.67,43.18 68.94,43.18 70.21,43.18 67.67,41.91 68.94,41.91 70.21,41.91 71.48,41.91 72.75,41.91 48.62,60.33 48.62,61.59 48.62,62.87 48.62,64.14 48.62,65.41 48.62,66.67 49.89,60.96 49.89,62.23 49.89,63.5 49.89,64.77 49.89,66.04 49.89,67.31 51.16,62.23 51.16,63.5 51.16,64.77 51.16,66.04 51.16,67.31 52.43,63.5 52.43,64.77 52.43,66.04 52.43,67.31 53.7,64.77 53.7,66.04 53.7,67.31 54.97,66.04 54.97,67.31 56.24,67.31 32.83,70.87
  pour Top (isolate 0.025): 80.01,46.35 67.94,46.35 66.67,45.09 66.67,41.27 74.93,41.27 76.83,43.18 80.01,43.18
  pour Top (isolate 0.025): 47.8,62.84 47.42,62.84 47.42,66.19 49.99,68.88 49.99,76.81 60.05,76.81 60.66,76.2 60.66,69.19 60.05,68.58 58.52,68.58 49.68,59.74 49.68,59.13 48.46,57.91 47.98,58.24 47.98,62.81
  pour Bottom (isolate 0.025): 48.26,59.69 48.26,66.67 50.16,68.58 60.33,68.58 63.5,65.41 68,65.41 70.92,62.48 70.92,46.35 71.12,46.35 80.01,46.35 80.01,43.18 79.38,43.18 76.83,43.18 74.93,41.27 66.67,41.27 66.67,45.09 67.94,46.35 67.94,58.42 66.67,59.69
  pour Top (isolate 0.025): 51.44,9.53 59.69,9.53 61.59,11.43 61.59,36.2 66.67,41.27 66.67,45.09 66.04,45.09 57.15,36.2 57.15,13.34 54.61,10.79 51.44,10.79
  pour Top: 43,9.93 44.93,9.93 44.93,12.88 52.22,12.88 52.22,9.42 46.25,9.42 45.44,8.61 43,8.61
VCC  (via drill 0.6)
  Top 0.305: SJ1.3 35.31,2.16 34.92,1.78 34.92,1.42 34.27,0.76 30.79,0.76 30.25,1.29 SJ3.3 30.25,3.94 29.79,4.39 C21.2 29.75,4.4 31.9,6.55 31.9,8.08 32.77,8.94 35.67,8.94
  Top 0.406: U3.4 36.84,8.59 36.2,8.57 35.67,8.94 | SJ1.3 34.92,2.16 34.92,1.78 34.92,1.27 35.31,0.76 40.03,0.76 40.39,1.02 SJ2.3 40.39,0.89 40.56,0.76 46.43,0.76 v47.62,1.91
  Top 0.762: IC17.16 25.93,39.9 v25.4,39.37 25.39,39.35 C1.2
  Top 1.27: IC10.1 63.31,3.81 C27.2 63.95,3.81 71.12,3.81
  Top 1.422: 71.12,3.81 73.66,6.35 73.66,29.16 74.98,30.48 BACKUP1.25 BACKUP1.26
  Bottom 0.305: C74.2 14.29,14.29 13.45,15.13 IC13.8
  Bottom 0.406: R85.1 R86.1 49.22,5.71 48.26,5.71 47.62,5.08 v47.62,1.91
  Bottom 0.762: 2.54,37.49 2.85,36.27 10.36,36.27 14.07,39.37 v25.4,39.37 25.4,30.48 27.3,28.57 SJ6.3
  Bottom 1.27: +X.3 3.81,74.93 2.54,73.66 2.54,60.96 | 2.54,60.96 2.54,58.42 | 2.54,58.42 2.54,45.72 | 3.81,44.45 2.54,43.18 | 2.54,43.18 2.54,45.72 | 2.54,43.18 2.54,37.49 2.54,30.48 | 2.54,30.48 3.81,29.21 | 3.81,29.21 -Y.3 | 2.54,60.96 3.81,59.69 | -X.3 3.81,59.69 | 2.54,58.42 3.81,59.69 | +Y.3 3.81,44.45 | 3.81,44.45 2.54,45.72 | 15.39,20.12 14.78,20.73 3.96,20.73 2.54,22.45 2.54,30.48 | 2.74,28.14 3.81,29.21 | C74.2 15.28,14.33 15.14,14.33 15.39,14.58 15.39,20.12 | 15.39,20.12 15.39,22.71 16.46,23.77 68.28,23.77 74.98,30.48 BACKUP1.25 BACKUP1.26 | R85.1 60.14,6.03 60.96,5.21 IC10.1
VCEL
  Top 0.305: R79.1 R55.2
  Top 0.406: R82.2 16.89,13.59 15.88,14.61 R55.2
  Top 1.27: FOTOCELULA.1 22.86,7.62 20.32,10.16 20.32,12.64 R82.2 19.37,13.4 C64.2 26.21,13.83 C22.+ 29.61,14.61 R45.1
VOUT_BACKUP_3V3  (via drill 0.6)
  Top 0.406: BACKUP1.11 65.41,48.26 63.5,46.35 50.8,46.35 50.16,46.99 50.16,48.9 50.8,49.53 61.59,49.53 62.23,50.16 62.23,52.07 64.77,52.07 66.04,53.34 73.66,53.34 76.2,50.8 BACKUP1.9 BACKUP1.11 | BACKUP1.10 BACKUP1.12 BACKUP1.11
  Top 0.61: C47.+ 64.14,50.94 | 64.14,50.94 66.18,50.94 66.67,51.44 C50.1 | 64.14,50.94 v64.14,48.67 62.8,47.56 D1.A 55.2,47.56 L5.1
  Bottom 0.406: BACKUP1.11 BACKUP1.9 BACKUP1.10 | BACKUP1.11 77.47,47.85 80.16,47.85 80.16,51.21 77.42,51.21 77.42,48.26 | 77.42,47.85 77.42,48.26 | 77.42,48.26 BACKUP1.11
  Bottom 0.61: R65.1 63.75,49.28 v64.14,48.67
  pour Top (isolate 0.025): 50.16,49.53 50.16,46.99 50.8,46.35 63.5,46.35 65.41,48.26 80.01,48.26 80.01,50.8 76.2,50.8 73.66,53.34 66.04,53.34 64.77,52.07 62.23,52.07 62.23,50.16 61.59,49.53
VOUT_BACKUP_5V  (via drill 0.6)
  Top 0.406: C53.1 38.1,81.92 | 38.1,81.92 38.73,82.41 38.63,84.45 | 38.63,84.45 C52.+ | 41.9,85.27 68.4,85.27 75.54,79.07 | 38.1,81.92 44.45,81.92 45.72,83.19 39.37,83.19 | 38.1,83.19 37.47,83.19 37.47,83.82 | 37.47,83.82 37.47,86.36 39.37,86.36 39.37,83.82 | 39.37,83.82 39.37,83.19 | 39.37,83.19 38.73,83.19 | 38.73,83.19 38.1,83.82 | 38.1,83.82 39.37,83.82 | 39.37,83.82 38.73,83.19 | 38.73,83.19 38.1,83.19 | 38.1,83.19 37.47,83.82 | 37.47,83.82 38.1,83.82 | 38.1,80.64 38.1,83.82 | v41.38,84.3 40.01,82.55 40.01,83.07 38.63,84.45
  Top 0.61: L7.1 41.9,85.27 C52.+
  Bottom 0.406: BACKUP1.5 BACKUP1.6 BACKUP1.8 BACKUP1.7 BACKUP1.5 | 75.54,79.07 74.93,57.15 76.2,55.88 BACKUP1.5 | R69.1 38.8,81.98 v41.38,84.3
  other vias: 72.67,79.25 71.15,79.25 69.62,79.25 68.1,79.25 66.57,79.25 65.35,80.16 65.35,81.69 65.35,83.21 65.35,84.73 65.35,86.26 66.57,80.77 68.1,80.77 69.62,80.77 71.15,80.77 72.67,80.77 74.02,79.71 75.54,79.71 66.52,82.42 68.05,82.42 69.57,82.42 71.09,82.42 72.62,82.42 66.57,83.95 68.1,83.95 69.62,83.95 71.15,83.95 72.67,83.95 66.55,85.47 68.07,85.47 69.6,85.47 71.12,85.47 72.64,85.47 66.55,87 68.07,87 69.6,87 71.12,87
  pour Top (isolate 0.025): 37.47,87.63 71.75,87.63 73.03,86.36 73.03,80.64 76.2,80.64 76.2,78.74 66.04,78.74 64.77,80.01 64.77,82.55 64.14,83.19 46.02,83.19 46,81.94 45.09,81.28 44.45,80.64 37.47,80.64 36.83,81.28 36.83,87
  pour Bottom (isolate 0.025): 80.01,53.34 73.03,53.34 71.75,54.61 71.75,78.74 66.04,78.74 64.77,80.01 64.77,82.55 64.14,83.19 64.14,87 64.77,87.63 71.75,87.63 73.03,86.36 73.03,81.28 73.66,80.64 76.2,80.64 76.2,78.74 75.56,78.74 75.56,56.52 76.2,55.88 80.01,55.88
VOUT_BACKUP_12V  (via drill 0.6)
  Top 0.406: BACKUP1.2 BACKUP1.4 BACKUP1.3 BACKUP1.1 | BACKUP1.1 77.47,71.75 76.83,72.39 76.66,72.39 76.5,72.54 73.15,72.54 | 73.15,72.54 66.45,72.54 65.84,73.15 65.84,76.81 66.14,77.11 78.33,77.11 80.16,75.29 80.16,59.13 79.86,58.22 | C49.1 72.9,72.8 73.15,72.54 | 77.47,58.47 77.42,58.52 | 77.47,58.47 77.72,58.22 77.72,58.67 BACKUP1.2 | 77.47,58.47 BACKUP1.1 | BACKUP1.1 BACKUP1.2
  Top 0.61: v69.8,76.86 69.8,74.76 C48.+
  Top 1.422: D3.C 69.93,74.67 C48.+ 70.02,74.73 72.24,74.73 72.9,74.07 C49.1
  Bottom 0.406: 77.72,58.22 77.72,60.96 80.47,60.96 80.47,57.91 77.42,57.91 77.42,58.42 BACKUP1.3
  Bottom 0.61: R67.1 69.95,76.71 v69.8,76.86
  pour Top (isolate 0.025): 77.47,58.42 80.01,58.42 80.01,75.56 78.11,77.47 66.19,77.47 65.84,77.11 65.84,73.15 66.45,72.54 76.5,72.54 77.42,71.63 77.42,59.16 77.62,59.16

### Text on the board
tNames: 1 | 1 | +VFOTO_CELL | 2 | GND | 2 | 3 | VCC | 4 | SENSOR_TEMP | 3 | 5 | GND | 4 | 5 | 1 | 2 | 3 | 12V | 4 | 5 | 5V | 1 | 3V3 | 2 | 3 | VBAT | 4 | 5 | GND | STAT1 | 1 | STAT2 | AUX | 2 | TEMP | 3 | VCC | AUX4 | AUX1 | 4 | AUX2 | 5 | AUX3 | V_EXTERNO | GND
bNames: 1 | +VFOTO_CELL | 1 | GND | 2 | 2 | VCC | 3 | SENSOR_TEMP | 4 | 3 | GND | 5 | 4 | 5 | CUBESAT_POT-BACKUP | 1 | REV.1 2015 | 2 | ARNALDO VIANA | OTAVIO PETITO | 12V | 3 | TIAGO DEMAY | 4 | 5 | 5V | 1 | 3V3 | 2 | 3 | 4 | 5 | GND | STAT1 | 1 | STAT2 | AUX | 2 | TEMP | 3 | VCC | AUX4 | AUX1 | 4 | AUX2 | 5 | AUX3 | V_EXTERNO | GND